# EAGLE schematic qo-100-upconverter (EAGLE 9.6.2)
CREVISION: 3; DESIGNER: Joao Silva

## Sheet 1 of 7: MCU
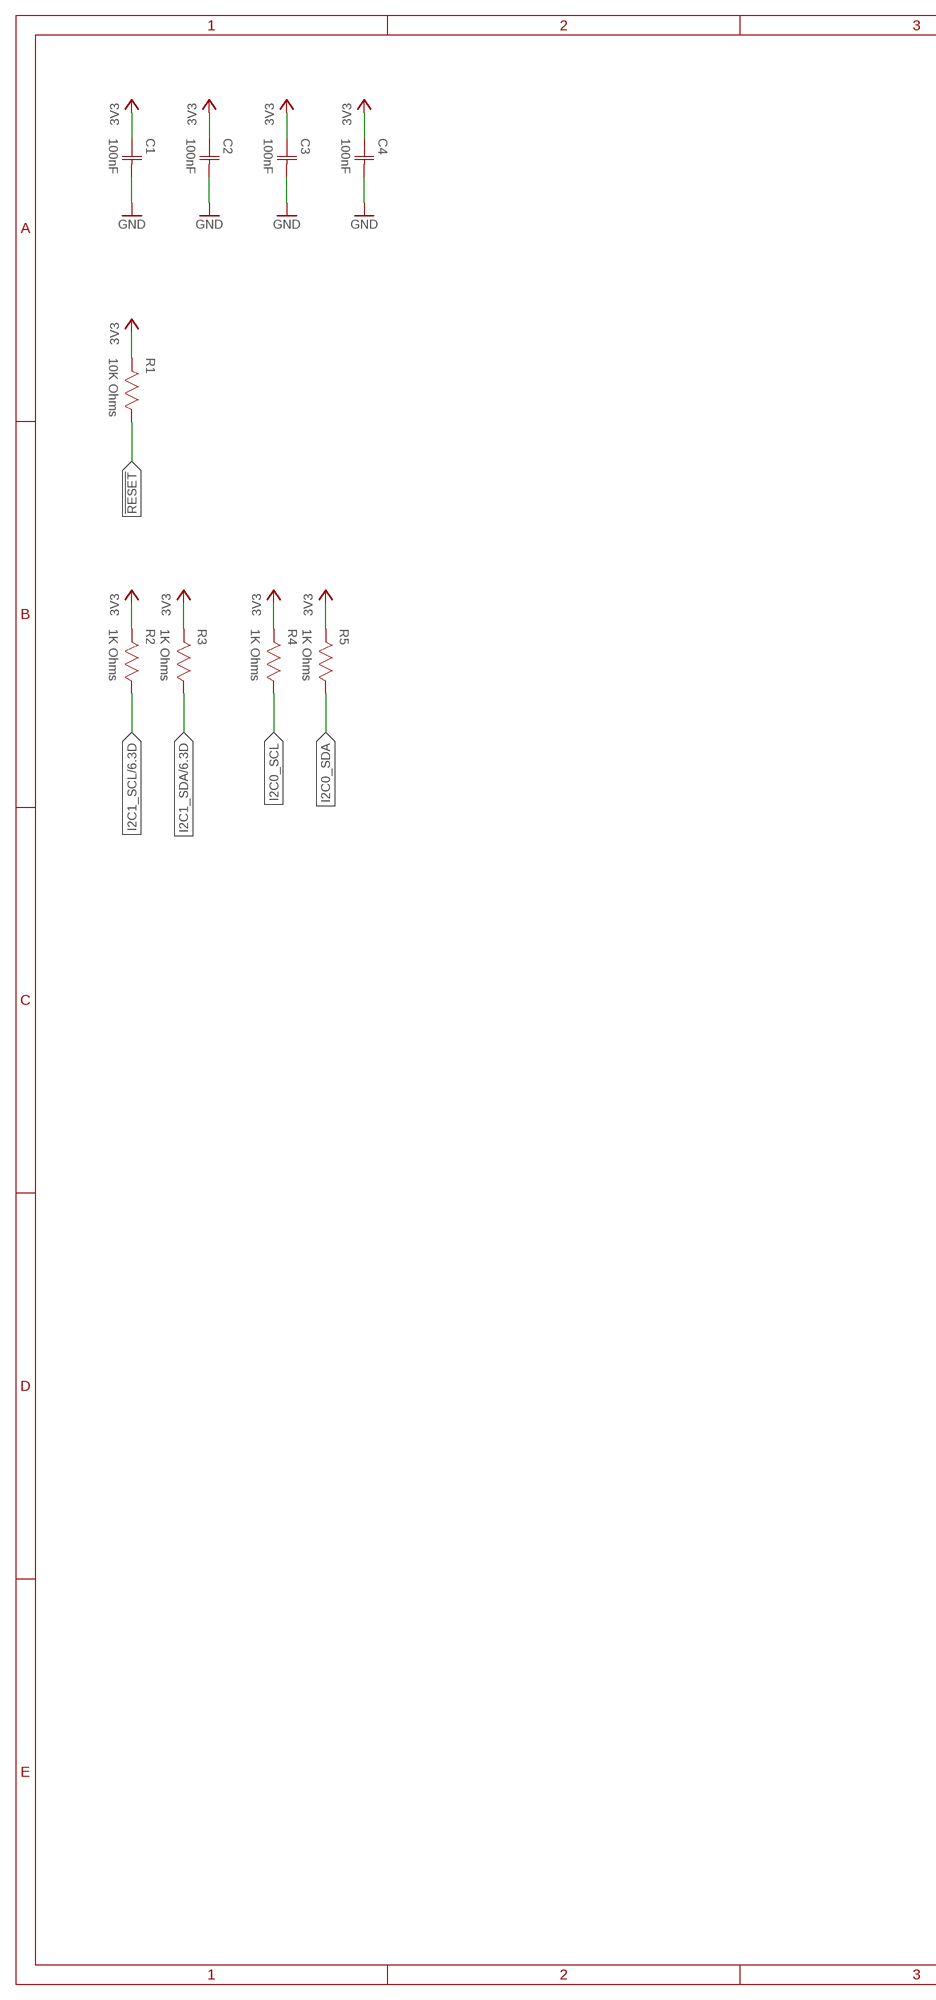
[diagram p0: schematic, sheet 1, part 1 of 2]
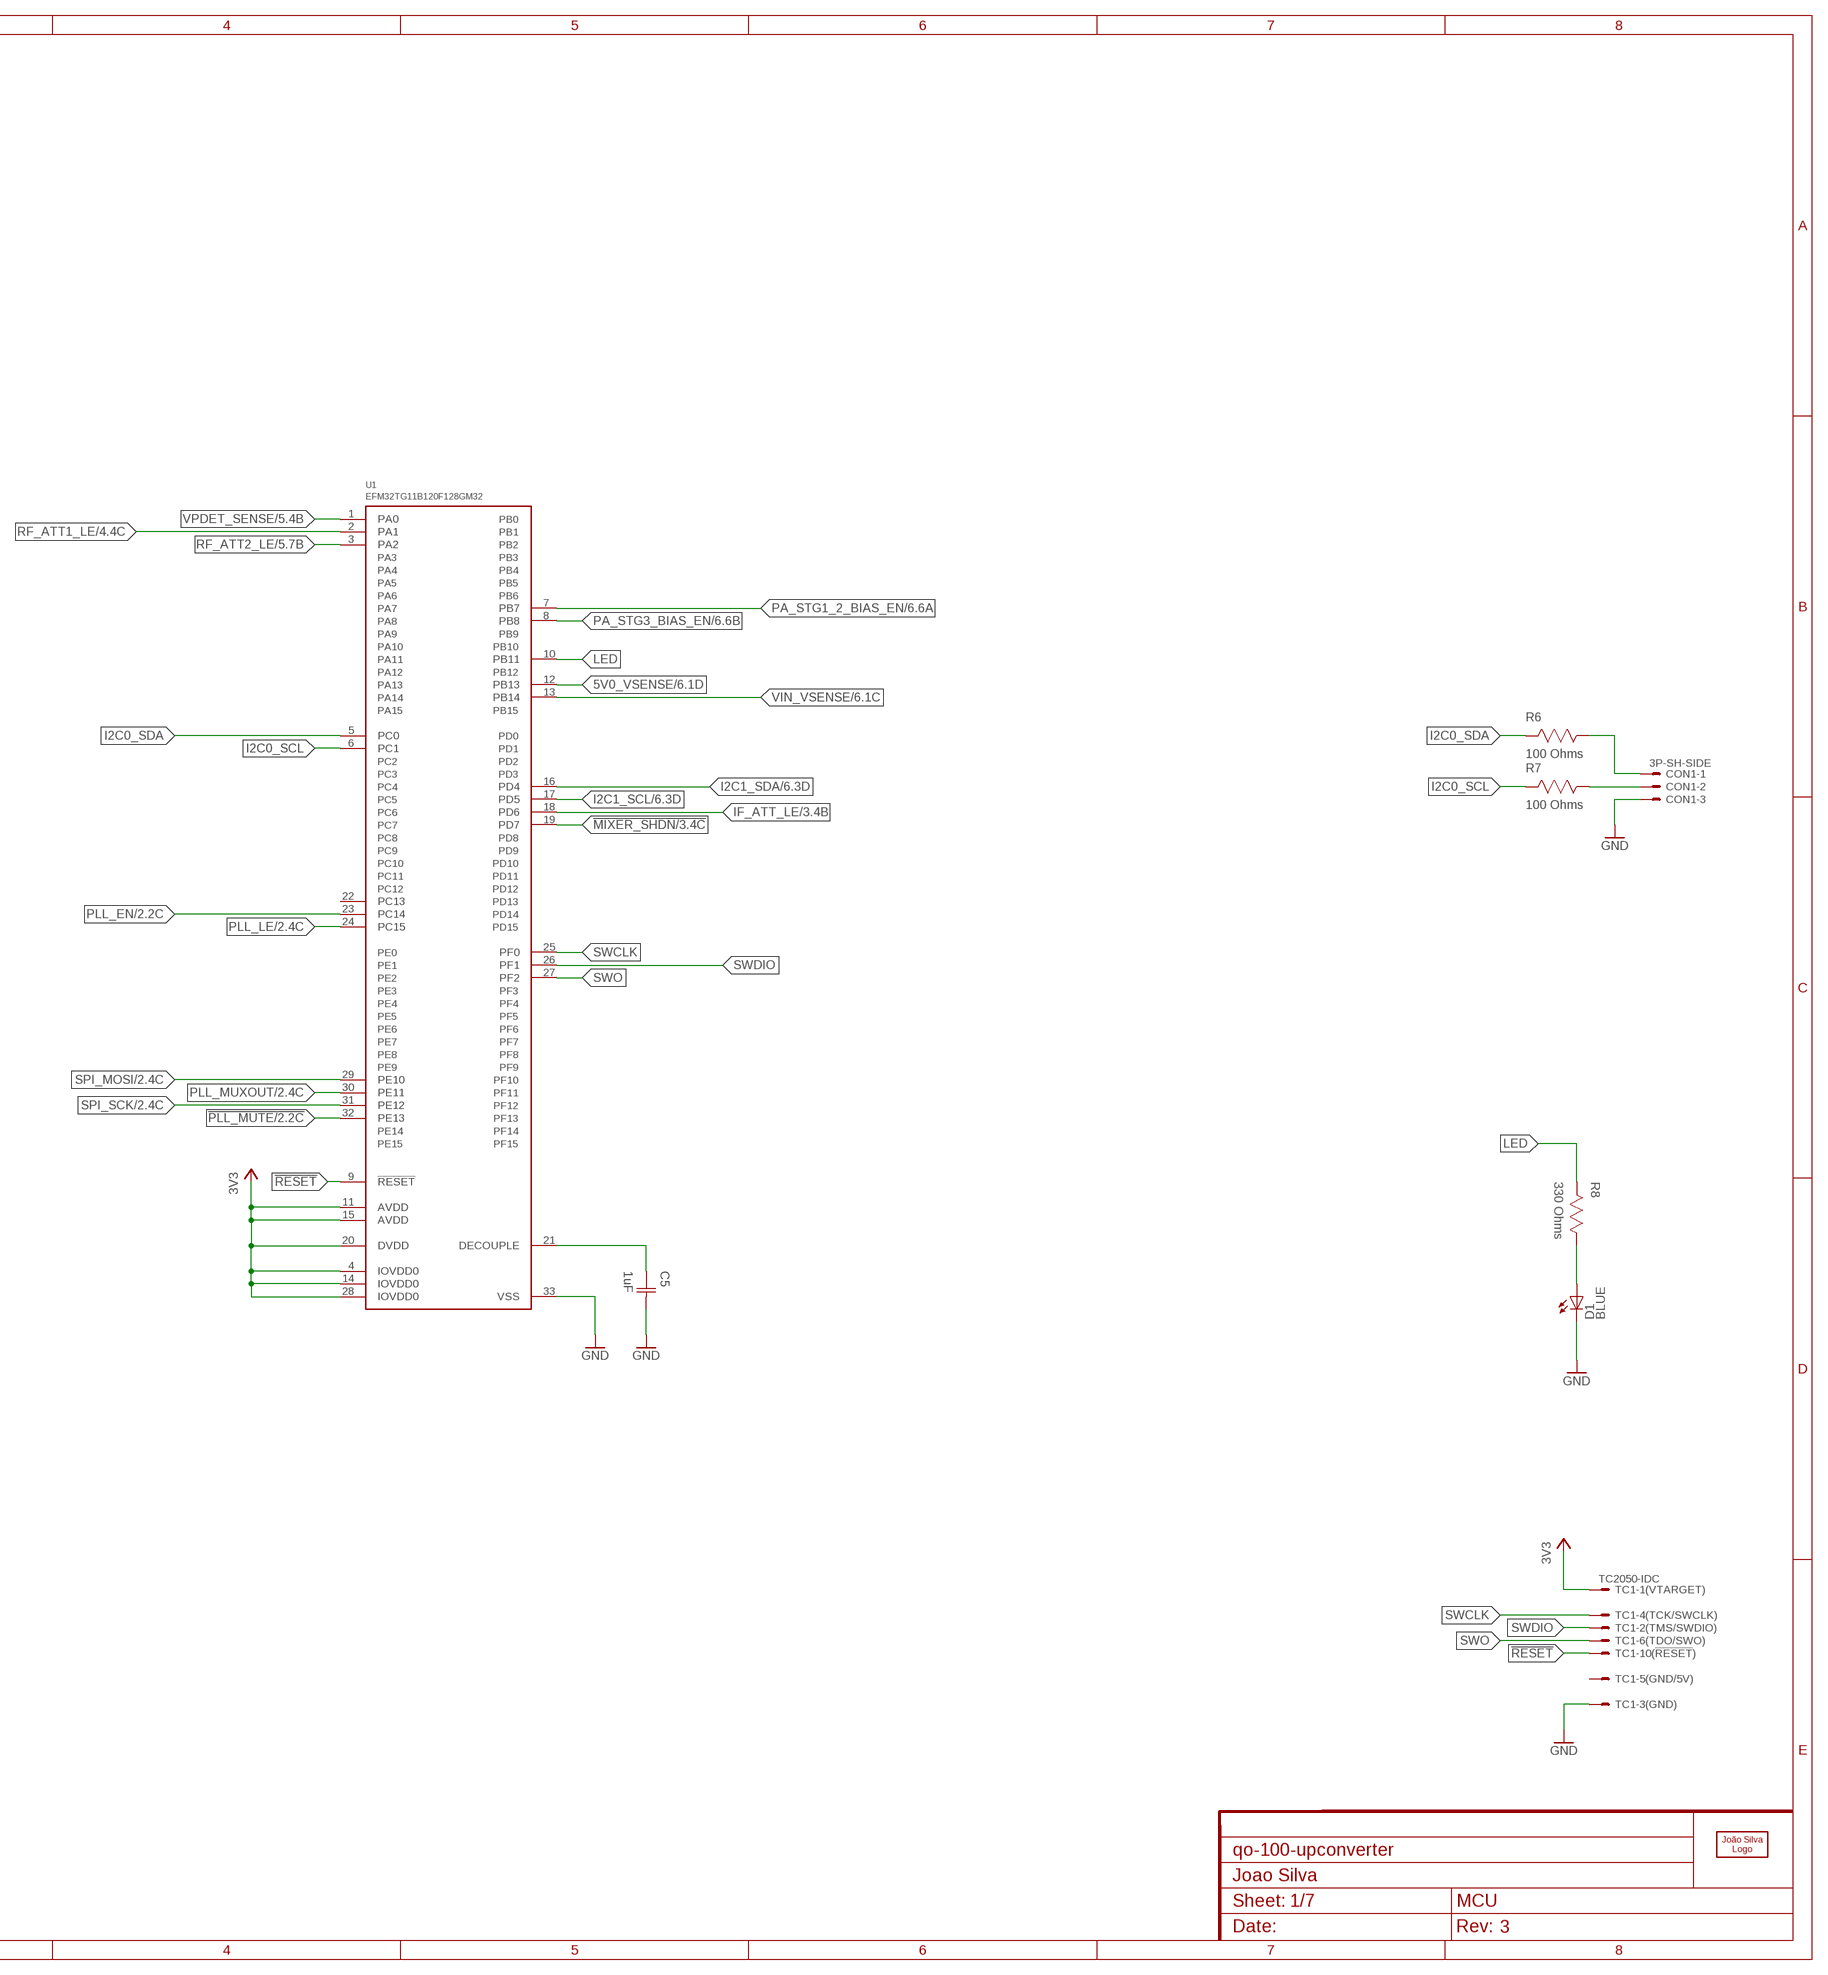
[diagram p1: schematic, sheet 1, part 2 of 2]

### Parts
C1  100nF  CAPACITOR-0603  [CAP0603]
C2  100nF  CAPACITOR-0603  [CAP0603]
C3  100nF  CAPACITOR-0603  [CAP0603]
C4  100nF  CAPACITOR-0603  [CAP0603]
C5  1uF  CAPACITOR-0603  [CAP0603]
CON1  3P-SH-SIDE  [SH-03-SIDE]
D1  LED0603  [0603]
LOGO1  JS-5MM  [JS_5MM]
R1  10K Ohms  RESISTOR-0603  [RES0603]
R2  1K Ohms  RESISTOR-0603  [RES0603]
R3  1K Ohms  RESISTOR-0603  [RES0603]
R4  1K Ohms  RESISTOR-0603  [RES0603]
R5  1K Ohms  RESISTOR-0603  [RES0603]
R6  100 Ohms  RESISTOR-0603  [RES0603]
R7  100 Ohms  RESISTOR-0603  [RES0603]
R8  330 Ohms  RESISTOR-0603  [RES0603]
TC1  TC2050-IDC  [TC2050-IDC]
U1  EFM32TG11B120F128GM32  [QFN32_0.5P_TG]

### Nets
3V3: C1.1(C1) C2.1(C1) C3.1(C1) C4.1(C1) R1.2 R2.2 R3.2 R4.2 R5.2 TC1.1 U1.4(IOVDD0) U1.11(AVDD) U1.14(IOVDD0) U1.15(AVDD) U1.20(DVDD) U1.28(IOVDD0) ; also sheet 6
5V0_VSENSE: U1.12(PB13) ; also sheet 6
!MIXER_SHDN: U1.19(PD7) ; also sheet 3
!PLL_MUTE: U1.32(PE13) ; also sheet 2
!RESET: R1.1 TC1.10 U1.9(!RESET)
GND: C1.2(C2) C2.2(C2) C3.2(C2) C4.2(C2) C5.2(C2) CON1.3 D1.C TC1.3 U1.33(VSS) ; also sheet 2,3,4,5,6
I2C0_SCL: R4.1 R7.2 U1.6(PC1)
I2C0_SDA: R5.1 R6.2 U1.5(PC0)
I2C1_SCL: R2.1 U1.17(PD5) ; also sheet 6
I2C1_SDA: R3.1 U1.16(PD4) ; also sheet 6
IF_ATT_LE: U1.18(PD6) ; also sheet 3
LED: R8.2 U1.10(PB11)
N$11: CON1.2 R7.1
N$17: CON1.1 R6.1
N$22: C5.1(C1) U1.21(DECOUPLE)
N$25: D1.A R8.1
PA_STG1_2_BIAS_EN: U1.7(PB7) ; also sheet 6
PA_STG3_BIAS_EN: U1.8(PB8) ; also sheet 6
PLL_EN: U1.23(PC14) ; also sheet 2
PLL_LE: U1.24(PC15) ; also sheet 2
PLL_MUXOUT: U1.30(PE11) ; also sheet 2
RF_ATT1_LE: U1.2(PA1) ; also sheet 4
RF_ATT2_LE: U1.3(PA2) ; also sheet 5
SPI_MOSI: U1.29(PE10) ; also sheet 2,3,4,5
SPI_SCK: U1.31(PE12) ; also sheet 2,3,4,5
SWCLK: TC1.4 U1.25(PF0)
SWDIO: TC1.2 U1.26(PF1)
SWO: TC1.6 U1.27(PF2)
VIN_VSENSE: U1.13(PB14) ; also sheet 6
VPDET_SENSE: U1.1(PA0) ; also sheet 5
Unconnected: TC1.5 TC1.7 TC1.8 TC1.9 U1.22(PC13)

## Sheet 2 of 7: LO Synthesizer
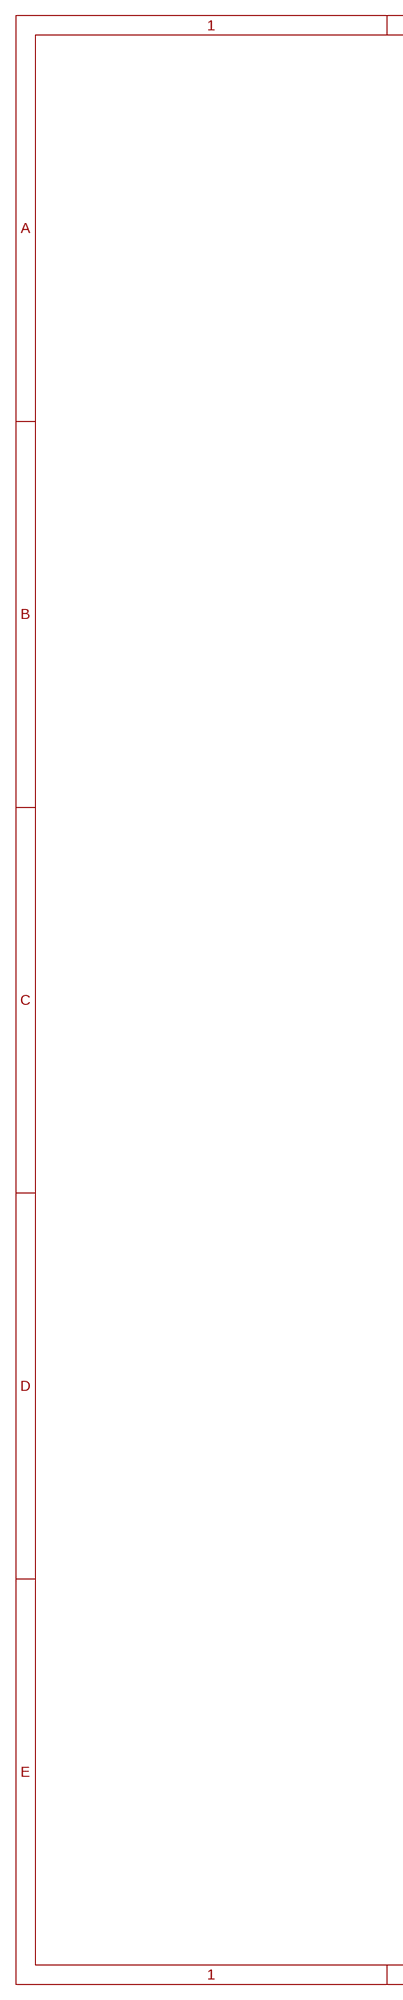
[diagram p2: schematic, sheet 2, part 1 of 2]
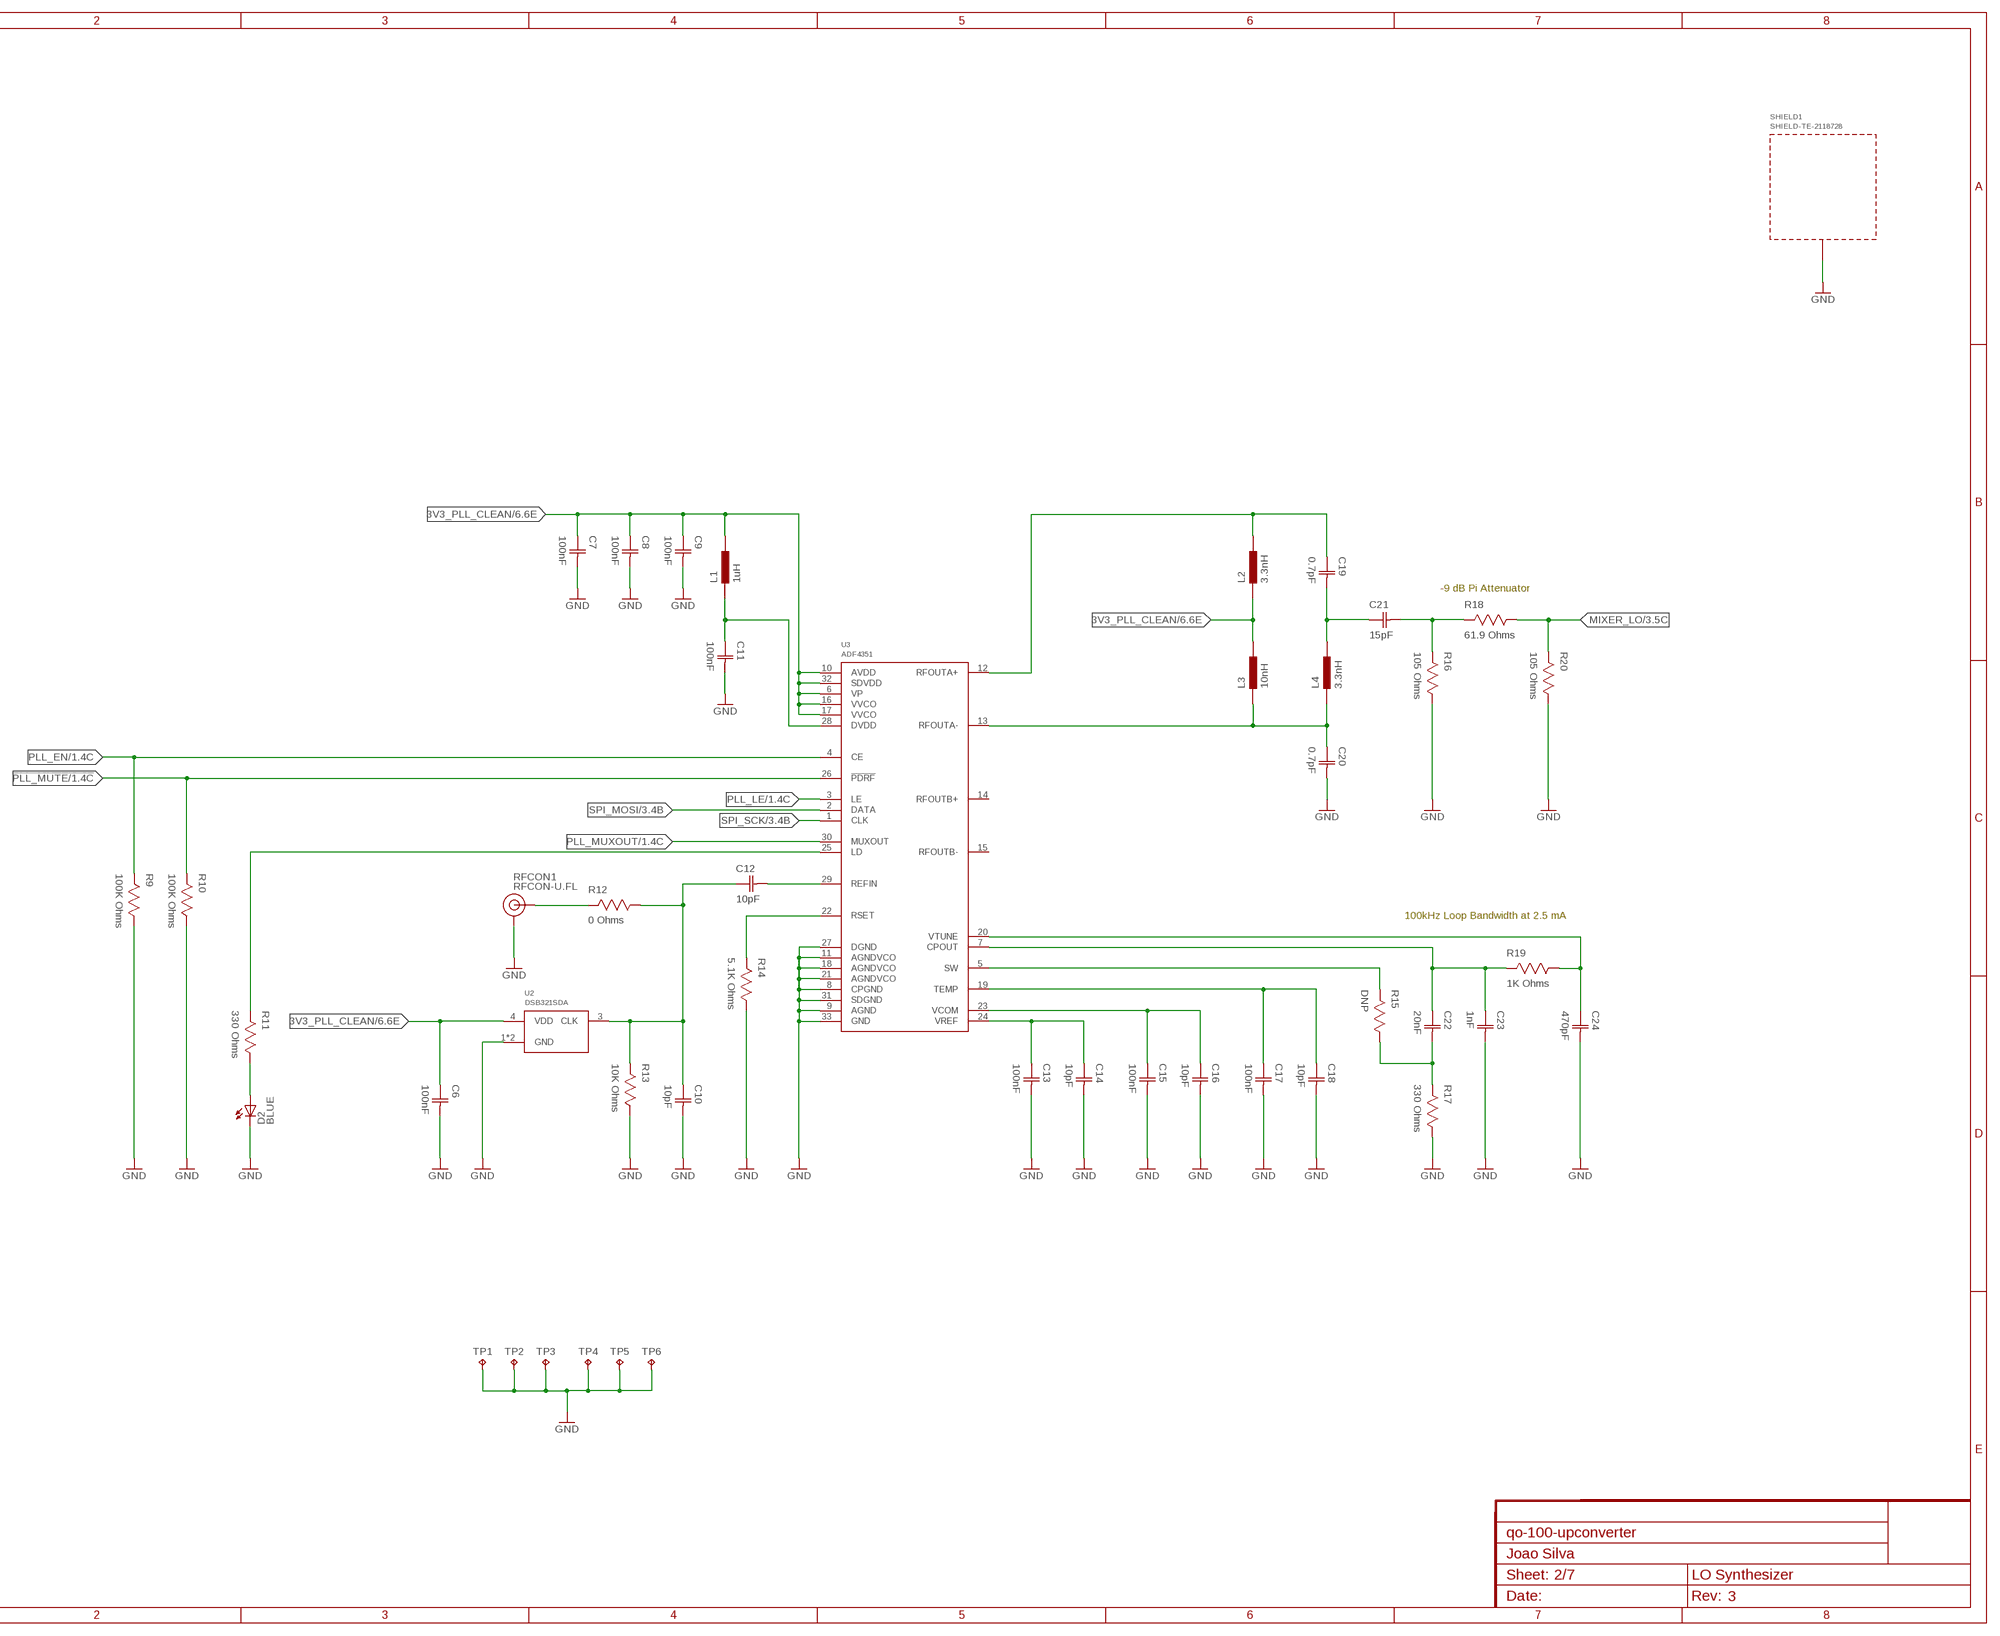
[diagram p3: schematic, sheet 2, part 2 of 2]

### Parts
C6  100nF  CAPACITOR-0603  [CAP0603]
C7  100nF  CAPACITOR-0603  [CAP0603]
C8  100nF  CAPACITOR-0603  [CAP0603]
C9  100nF  CAPACITOR-0603  [CAP0603]
C10  10pF  CAPACITOR-0603  [CAP0603]
C11  100nF  CAPACITOR-0603  [CAP0603]
C12  10pF  CAPACITOR-0603  [CAP0603]
C13  100nF  CAPACITOR-0603  [CAP0603]
C14  10pF  CAPACITOR-0603  [CAP0603]
C15  100nF  CAPACITOR-0603  [CAP0603]
C16  10pF  CAPACITOR-0603  [CAP0603]
C17  100nF  CAPACITOR-0603  [CAP0603]
C18  10pF  CAPACITOR-0603  [CAP0603]
C19  0.7pF  CAPACITOR-0603  [CAP0603]
C20  0.7pF  CAPACITOR-0603  [CAP0603]
C21  15pF  CAPACITOR-0603  [CAP0603]
C22  20nF  CAPACITOR-0603  [CAP0603]
C23  1nF  CAPACITOR-0603  [CAP0603]
C24  470pF  CAPACITOR-0603  [CAP0603]
D2  LED0603  [0603]
L1  1uH  INDUCTOR-0603  [IND0603]
L2  3.3nH  INDUCTOR-0603  [IND0603]
L3  10nH  INDUCTOR-0603  [IND0603]
L4  3.3nH  INDUCTOR-0603  [IND0603]
R9  100K Ohms  RESISTOR-0603  [RES0603]
R10  100K Ohms  RESISTOR-0603  [RES0603]
R11  330 Ohms  RESISTOR-0603  [RES0603]
R12  0 Ohms  RESISTOR-0603  [RES0603]
R13  10K Ohms  RESISTOR-0603  [RES0603]
R14  5.1K Ohms  RESISTOR-0603  [RES0603]
R15  DNP  RESISTOR-0603  [RES0603]
R16  105 Ohms  RESISTOR-0603  [RES0603]
R17  330 Ohms  RESISTOR-0603  [RES0603]
R18  61.9 Ohms  RESISTOR-0603  [RES0603]
R19  1K Ohms  RESISTOR-0603  [RES0603]
R20  105 Ohms  RESISTOR-0603  [RES0603]
RFCON1  RFCON-U.FL  [U.FL]
SHIELD1  SHIELD-TE-2118728  [2118728]
TP1  TESTPOINT-1.27MM  [PAD1.27MM]
TP2  TESTPOINT-1.27MM  [PAD1.27MM]
TP3  TESTPOINT-1.27MM  [PAD1.27MM]
TP4  TESTPOINT-1.27MM  [PAD1.27MM]
TP5  TESTPOINT-1.27MM  [PAD1.27MM]
TP6  TESTPOINT-1.27MM  [PAD1.27MM]
U2  DSB321SDA  [TCXO-3225]
U3  ADF4351  [QFN32]

### Nets
3V3_PLL_CLEAN: C6.1(C1) C7.1(C1) C8.1(C1) C9.1(C1) L1.2 L2.1 L3.2 U2.4(VDD) U3.6(VP) U3.10(AVDD) U3.16(VVCO) U3.17(VVCO) U3.32(SDVDD) ; also sheet 6
!PLL_MUTE: R10.2 U3.26(!PDRF) ; also sheet 1
GND: C6.2(C2) C7.2(C2) C8.2(C2) C9.2(C2) C10.2(C2) C11.2(C2) C13.2(C2) C14.2(C2) C15.2(C2) C16.2(C2) C17.2(C2) C18.2(C2) C20.2(C2) C23.2(C2) C24.2(C2) D2.C R9.1 R10.1 R13.1 R14.1 R16.1 R17.1 R20.1 RFCON1.P$1(GND) RFCON1.P$2(GND) SHIELD1.1(GND) SHIELD1.2(GND) SHIELD1.3(GND) SHIELD1.4(GND) SHIELD1.5(GND) SHIELD1.6(GND) SHIELD1.7(GND) SHIELD1.8(GND) SHIELD1.9(GND) SHIELD1.10(GND) SHIELD1.11(GND) SHIELD1.12(GND) SHIELD1.13(GND) SHIELD1.14(GND) SHIELD1.15(GND) SHIELD1.16(GND) TP1.TP TP2.TP TP3.TP TP4.TP TP5.TP TP6.TP U2.1(GND) U2.2(GND) U3.8(CPGND) U3.9(AGND) U3.11(AGNDVCO) U3.18(AGNDVCO) U3.21(AGNDVCO) U3.27(DGND) U3.31(SDGND) U3.33(GND) ; also sheet 1,3,4,5,6
MIXER_LO: R18.1 R20.2 ; also sheet 3
N$1: C19.2(C2) C21.1(C1) L4.2
N$8: C11.1(C1) L1.1 U3.28(DVDD)
N$13: D2.A R11.1
N$21: R12.2 RFCON1.P$3(SIGNAL)
N$29: C21.2(C2) R16.2 R18.2
N$67: C20.1(C1) L3.1 L4.1 U3.13(RFOUTA-)
N$69: C19.1(C1) L2.2 U3.12(RFOUTA+)
N$84: C22.2(C2) R15.1 R17.2
N$88: R14.2 U3.22(RSET)
PLL_CP_VOUT: C22.1(C1) C23.1(C1) R19.2 U3.7(CPOUT)
PLL_EN: R9.2 U3.4(CE) ; also sheet 1
PLL_FASTLOCK_SW: R15.2 U3.5(SW)
PLL_LE: U3.3(LE) ; also sheet 1
PLL_LOCK: R11.2 U3.25(LD)
PLL_MUXOUT: U3.30(MUXOUT) ; also sheet 1
PLL_REF_ACC: C12.2(C2) U3.29(REFIN)
PLL_REF_DCC: C10.1(C1) C12.1(C1) R12.1 R13.2 U2.3(CLK)
PLL_TEMP: C17.1(C1) C18.1(C1) U3.19(TEMP)
PLL_VCOM: C15.1(C1) C16.1(C1) U3.23(VCOM)
PLL_VREF: C13.1(C1) C14.1(C1) U3.24(VREF)
PLL_VTUNE: C24.1(C1) R19.1 U3.20(VTUNE)
SPI_MOSI: U3.2(DATA) ; also sheet 1,3,4,5
SPI_SCK: U3.1(CLK) ; also sheet 1,3,4,5
Unconnected: U3.14(RFOUTB+) U3.15(RFOUTB-)

### Notes on the sheet
- -9 dB Pi Attenuator
- 100kHz Loop Bandwidth at 2.5 mA

## Sheet 3 of 7: IF + Mixer + LOL Filter
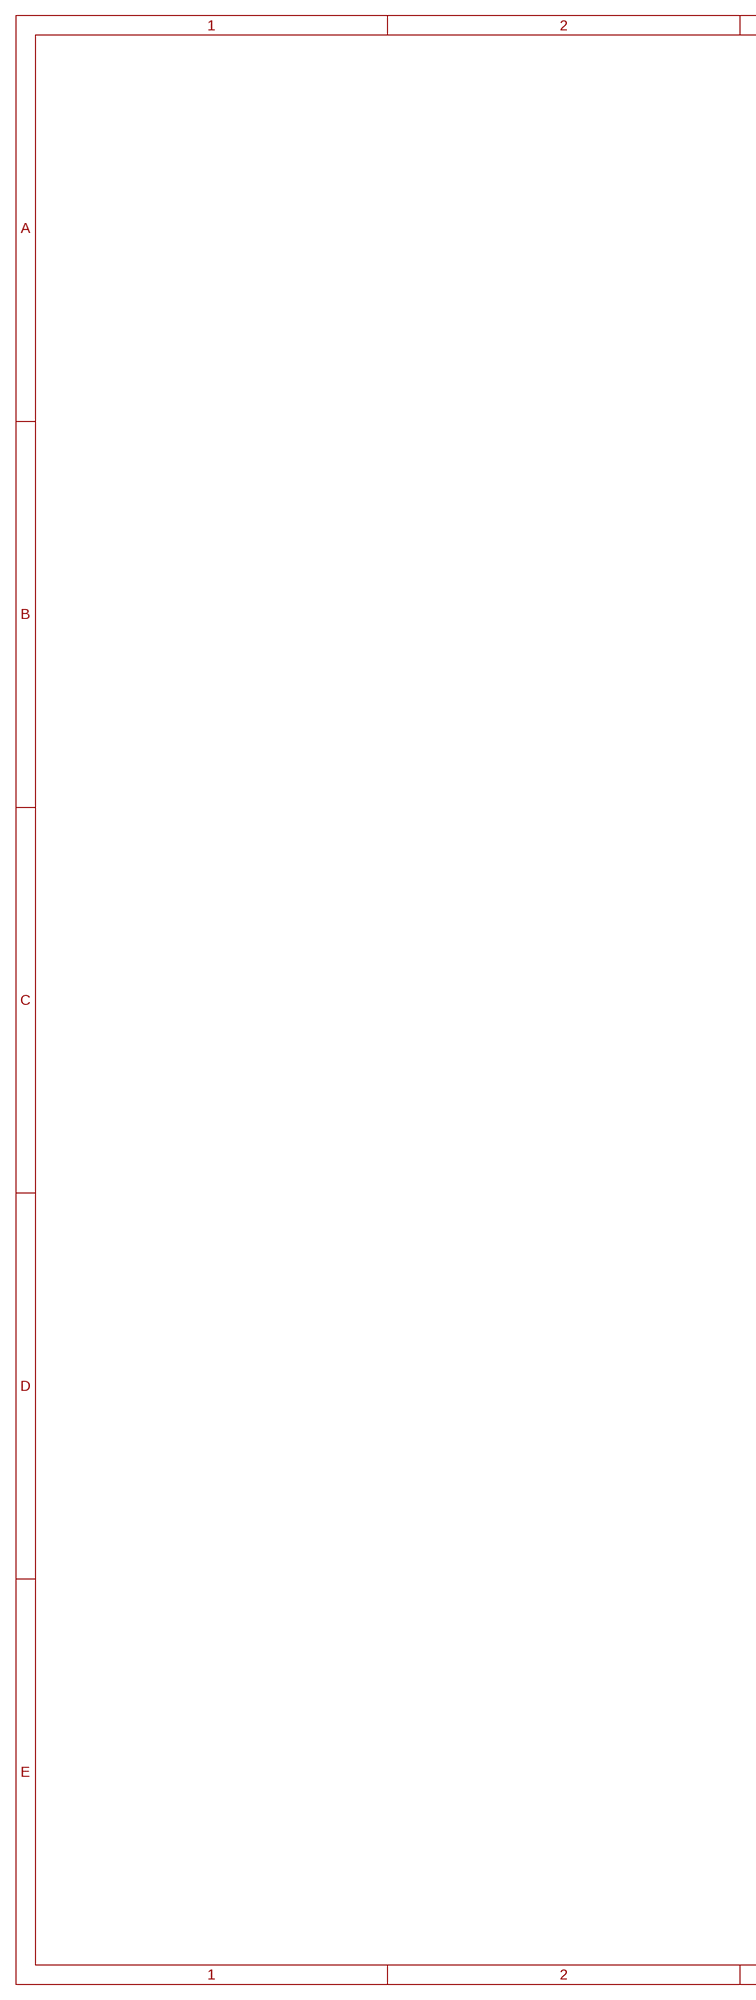
[diagram p4: schematic, sheet 3, part 1 of 2]
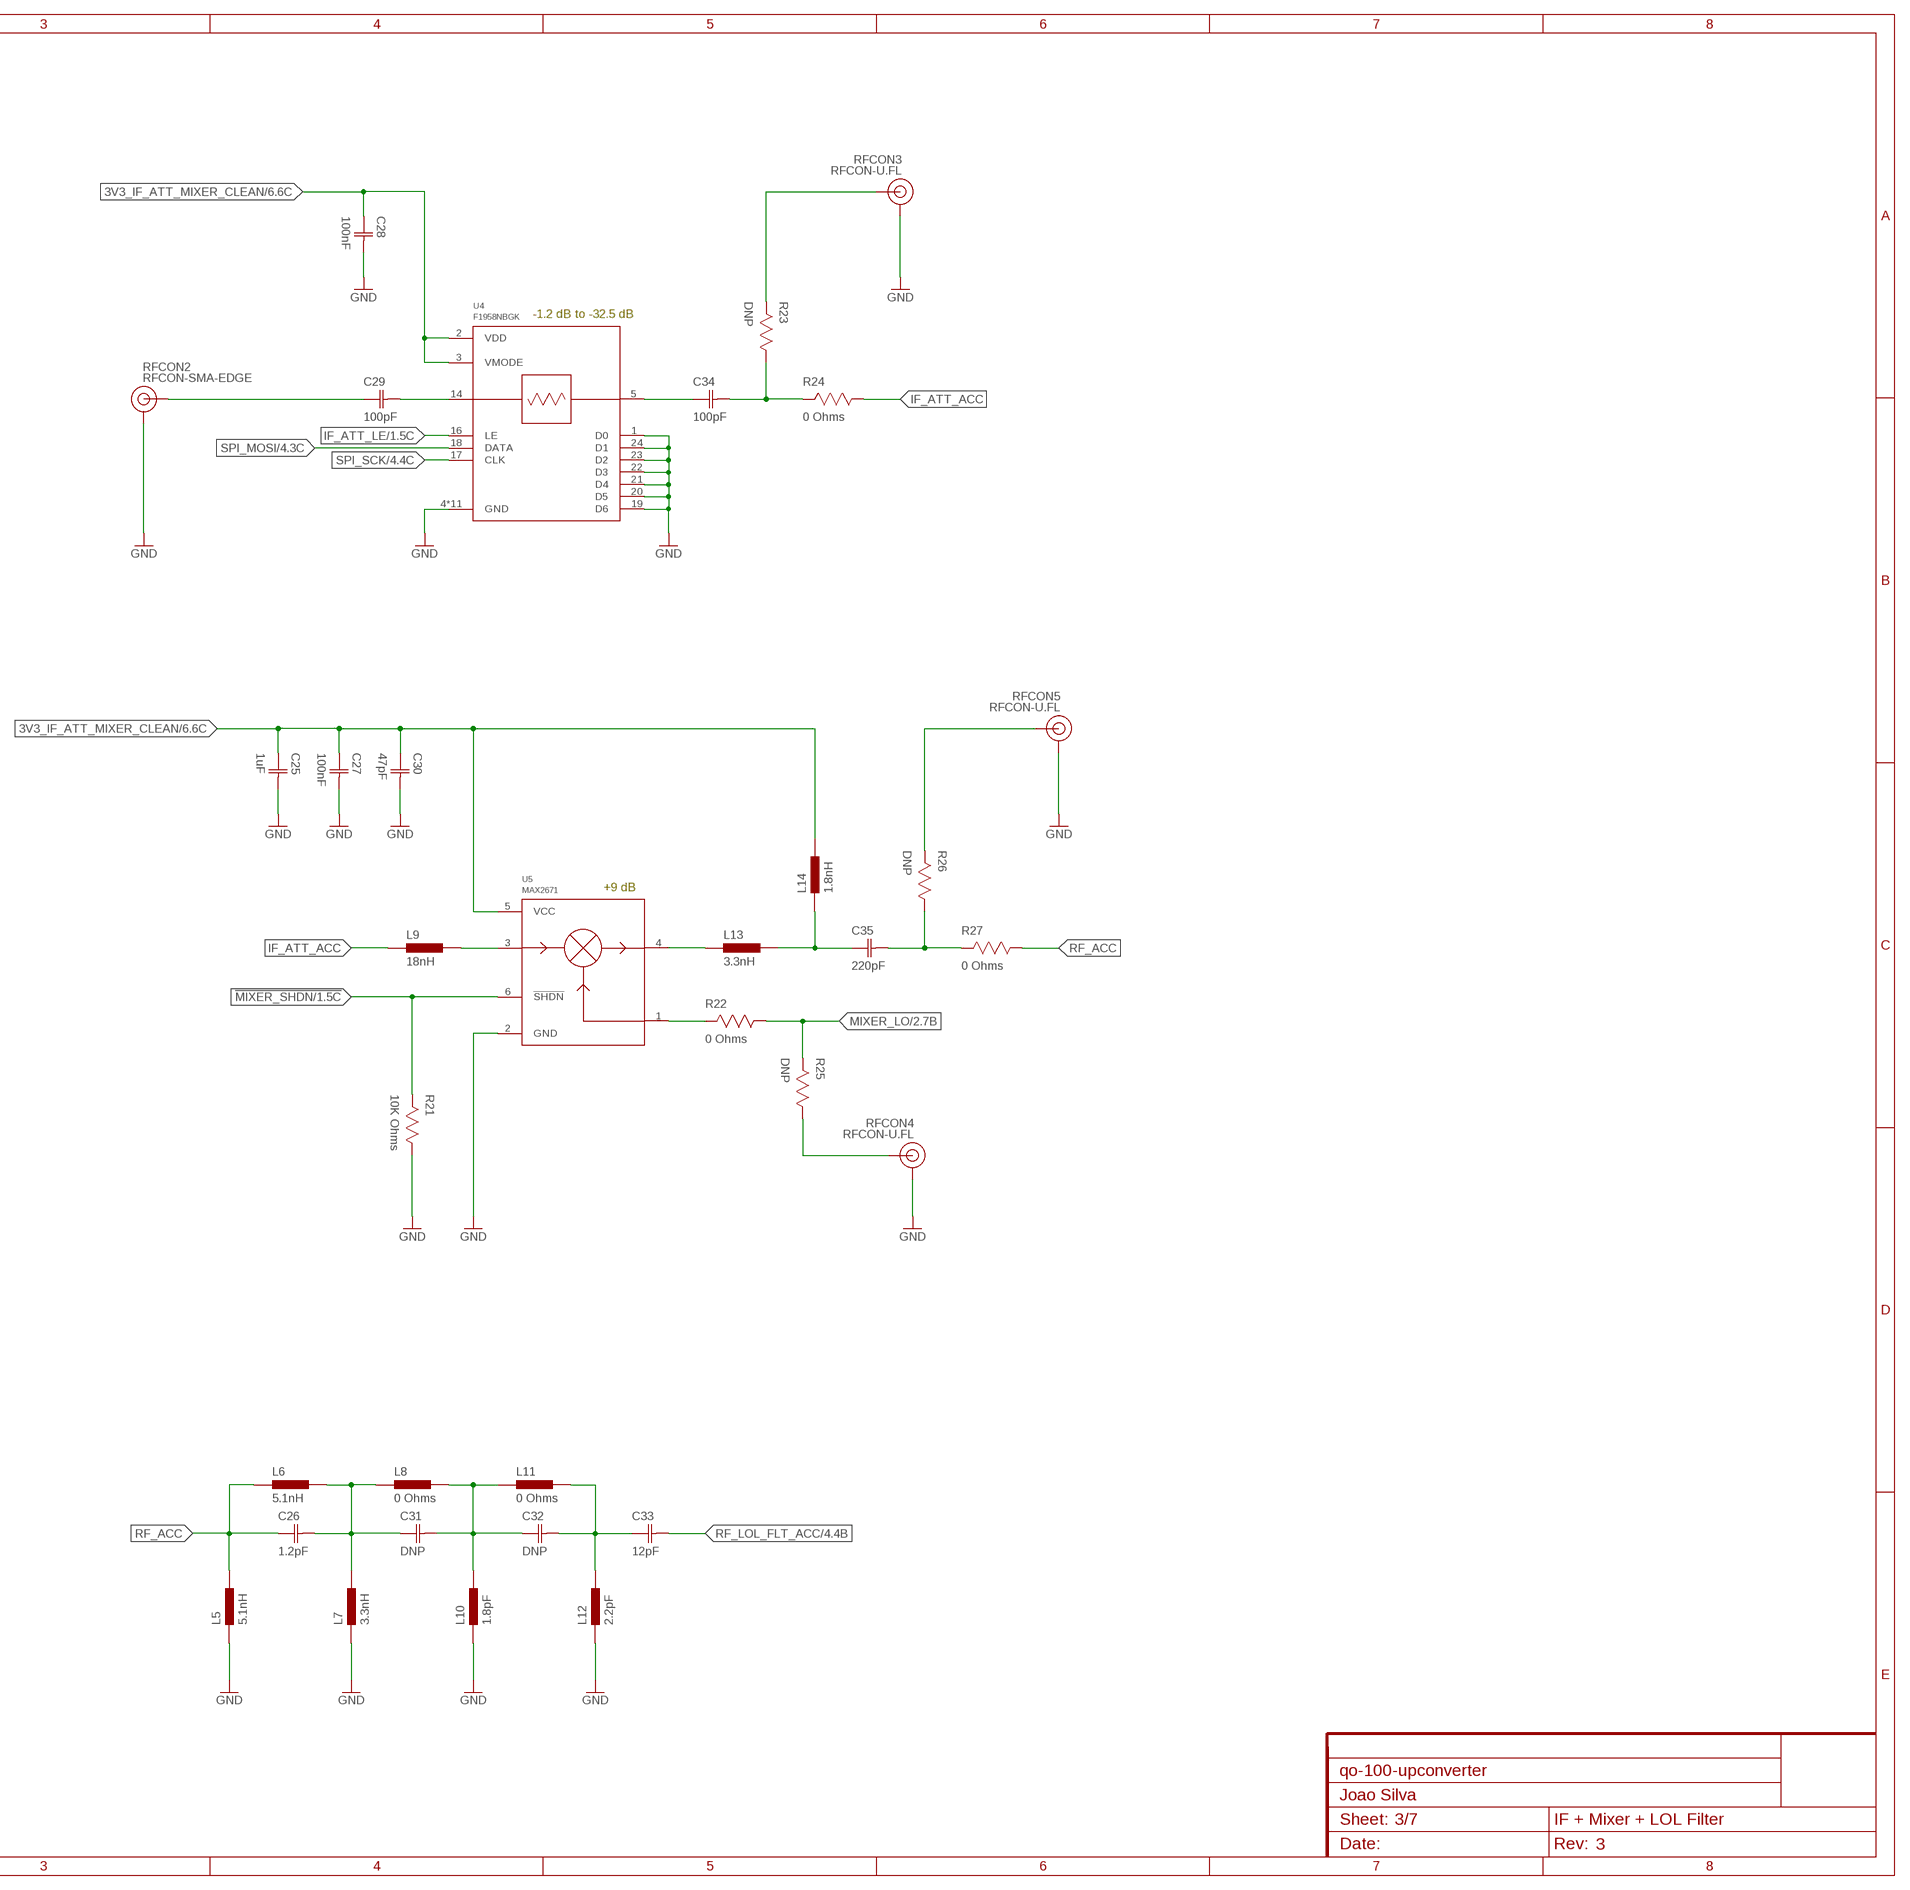
[diagram p5: schematic, sheet 3, part 2 of 2]

### Parts
C25  1uF  CAPACITOR-0603  [CAP0603]
C26  1.2pF  CAPACITOR-0603  [CAP0603]
C27  100nF  CAPACITOR-0603  [CAP0603]
C28  100nF  CAPACITOR-0603  [CAP0603]
C29  100pF  CAPACITOR-0603  [CAP0603]
C30  47pF  CAPACITOR-0603  [CAP0603]
C31  DNP  CAPACITOR-0603  [CAP0603]
C32  DNP  CAPACITOR-0603  [CAP0603]
C33  12pF  CAPACITOR-0603  [CAP0603]
C34  100pF  CAPACITOR-0603  [CAP0603]
C35  220pF  CAPACITOR-0603  [CAP0603]
L5  5.1nH  INDUCTOR-0603  [IND0603]
L6  5.1nH  INDUCTOR-0603  [IND0603]
L7  3.3nH  INDUCTOR-0603  [IND0603]
L8  0 Ohms  INDUCTOR-0603  [IND0603]
L9  18nH  INDUCTOR-0603  [IND0603]
L10  1.8pF  INDUCTOR-0603  [IND0603]
L11  0 Ohms  INDUCTOR-0603  [IND0603]
L12  2.2pF  INDUCTOR-0603  [IND0603]
L13  3.3nH  INDUCTOR-0603  [IND0603]
L14  1.8nH  INDUCTOR-0603  [IND0603]
R21  10K Ohms  RESISTOR-0603  [RES0603]
R22  0 Ohms  RESISTOR-0603  [RES0603]
R23  DNP  RESISTOR-0603  [RES0603]
R24  0 Ohms  RESISTOR-0603  [RES0603]
R25  DNP  RESISTOR-0603  [RES0603]
R26  DNP  RESISTOR-0603  [RES0603]
R27  0 Ohms  RESISTOR-0603  [RES0603]
RFCON2  RFCON-SMA-EDGE  [SMA-EDGE]
RFCON3  RFCON-U.FL  [U.FL]
RFCON4  RFCON-U.FL  [U.FL]
RFCON5  RFCON-U.FL  [U.FL]
U4  F1958NBGK  [QFN24_2]
U5  MAX2671  [SOT23-6]

### Nets
3V3_IF_ATT_MIXER_CLEAN: C25.1(C1) C27.1(C1) C28.1(C1) C30.1(C1) L14.2 U4.2(VDD) U4.3(VMODE) U5.5(VCC) ; also sheet 6
!MIXER_SHDN: R21.2 U5.6(!SHDN) ; also sheet 1
GND: C25.2(C2) C27.2(C2) C28.2(C2) C30.2(C2) L5.1 L7.1 L10.1 L12.1 R21.1 RFCON2.GND@0(GND) RFCON2.GND@1(GND) RFCON2.GND@2(GND) RFCON2.GND@3(GND) RFCON3.P$1(GND) RFCON3.P$2(GND) RFCON4.P$1(GND) RFCON4.P$2(GND) RFCON5.P$1(GND) RFCON5.P$2(GND) U4.1(D0) U4.4(GND) U4.6(GND) U4.7(GND) U4.8(GND) U4.9(GND) U4.10(GND) U4.11(GND) U4.12(GND) U4.13(GND) U4.15(GND) U4.19(D6) U4.20(D5) U4.21(D4) U4.22(D3) U4.23(D2) U4.24(D1) U4.25(GND) U5.2(GND) ; also sheet 1,2,4,5,6
IF_ATT_ACC: L9.1 R24.1
IF_ATT_ACC_PROBE: C34.2(C2) R23.1 R24.2
IF_ATT_DCC: C34.1(C1) U4.5(RF1)
IF_ATT_LE: U4.16(LE) ; also sheet 1
IF_IN_ACC: C29.2(C2) U4.14(RF2)
IF_IN_DCC: C29.1(C1) RFCON2.SIG(SIGNAL)
MIXER_IN_DCC: L9.2 U5.3(IFIN)
MIXER_LO: R22.1 R25.2 ; also sheet 2
MIXER_OUT_ACC_PROBE: C35.2(C2) R26.1 R27.2
MIXER_OUT_DCC: L13.1 U5.4(RFOUT)
N$6: C35.1(C1) L13.2 L14.1
N$24: R23.2 RFCON3.P$3(SIGNAL)
N$28: R26.2 RFCON5.P$3(SIGNAL)
N$32: C26.2(C2) C31.1(C1) L6.2 L7.2 L8.1
N$33: C31.2(C2) C32.1(C1) L8.2 L10.2 L11.1
N$34: C32.2(C2) C33.1(C1) L11.2 L12.2
N$45: R22.2 U5.1(LO)
N$47: R25.1 RFCON4.P$3(SIGNAL)
RF_ACC: C26.1(C1) L5.2 L6.1 R27.1
RF_LOL_FLT_ACC: C33.2(C2) ; also sheet 4
SPI_MOSI: U4.18(DATA) ; also sheet 1,2,4,5
SPI_SCK: U4.17(CLK) ; also sheet 1,2,4,5

### Notes on the sheet
- -1.2 dB to -32.5 dB
- +9 dB

## Sheet 4 of 7: Stage 1 & 2 amplifier
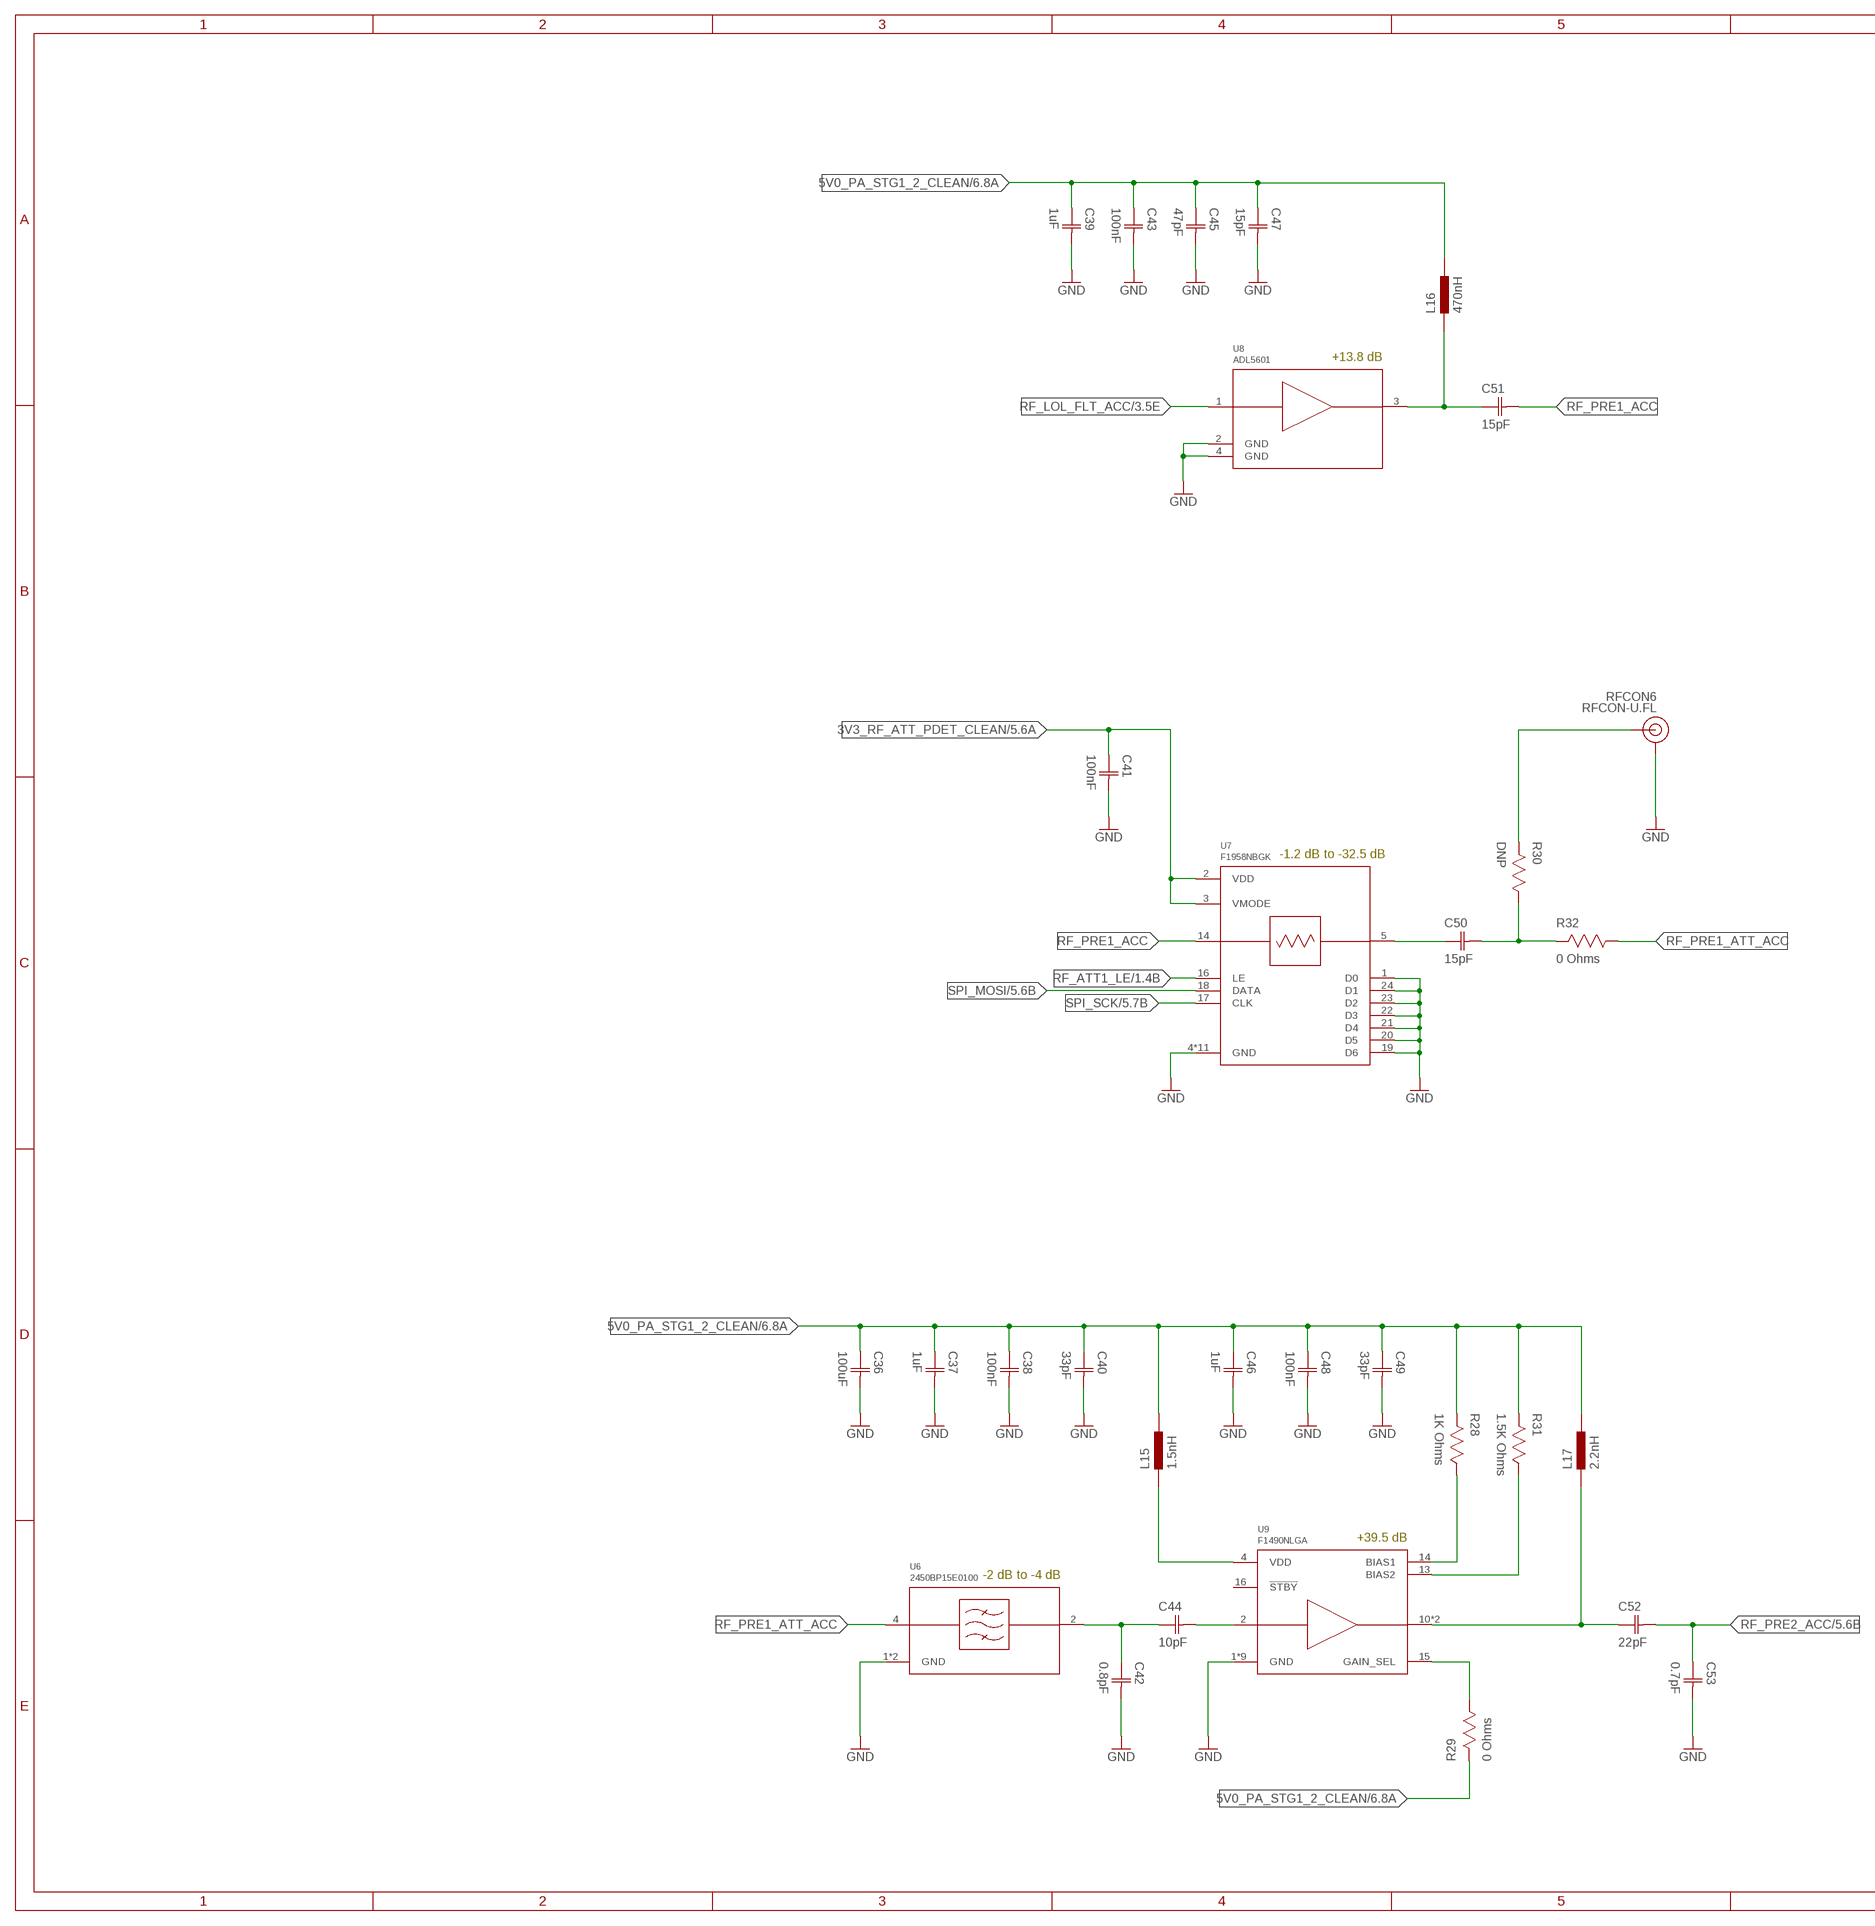
[diagram p6: schematic, sheet 4, part 1 of 2]
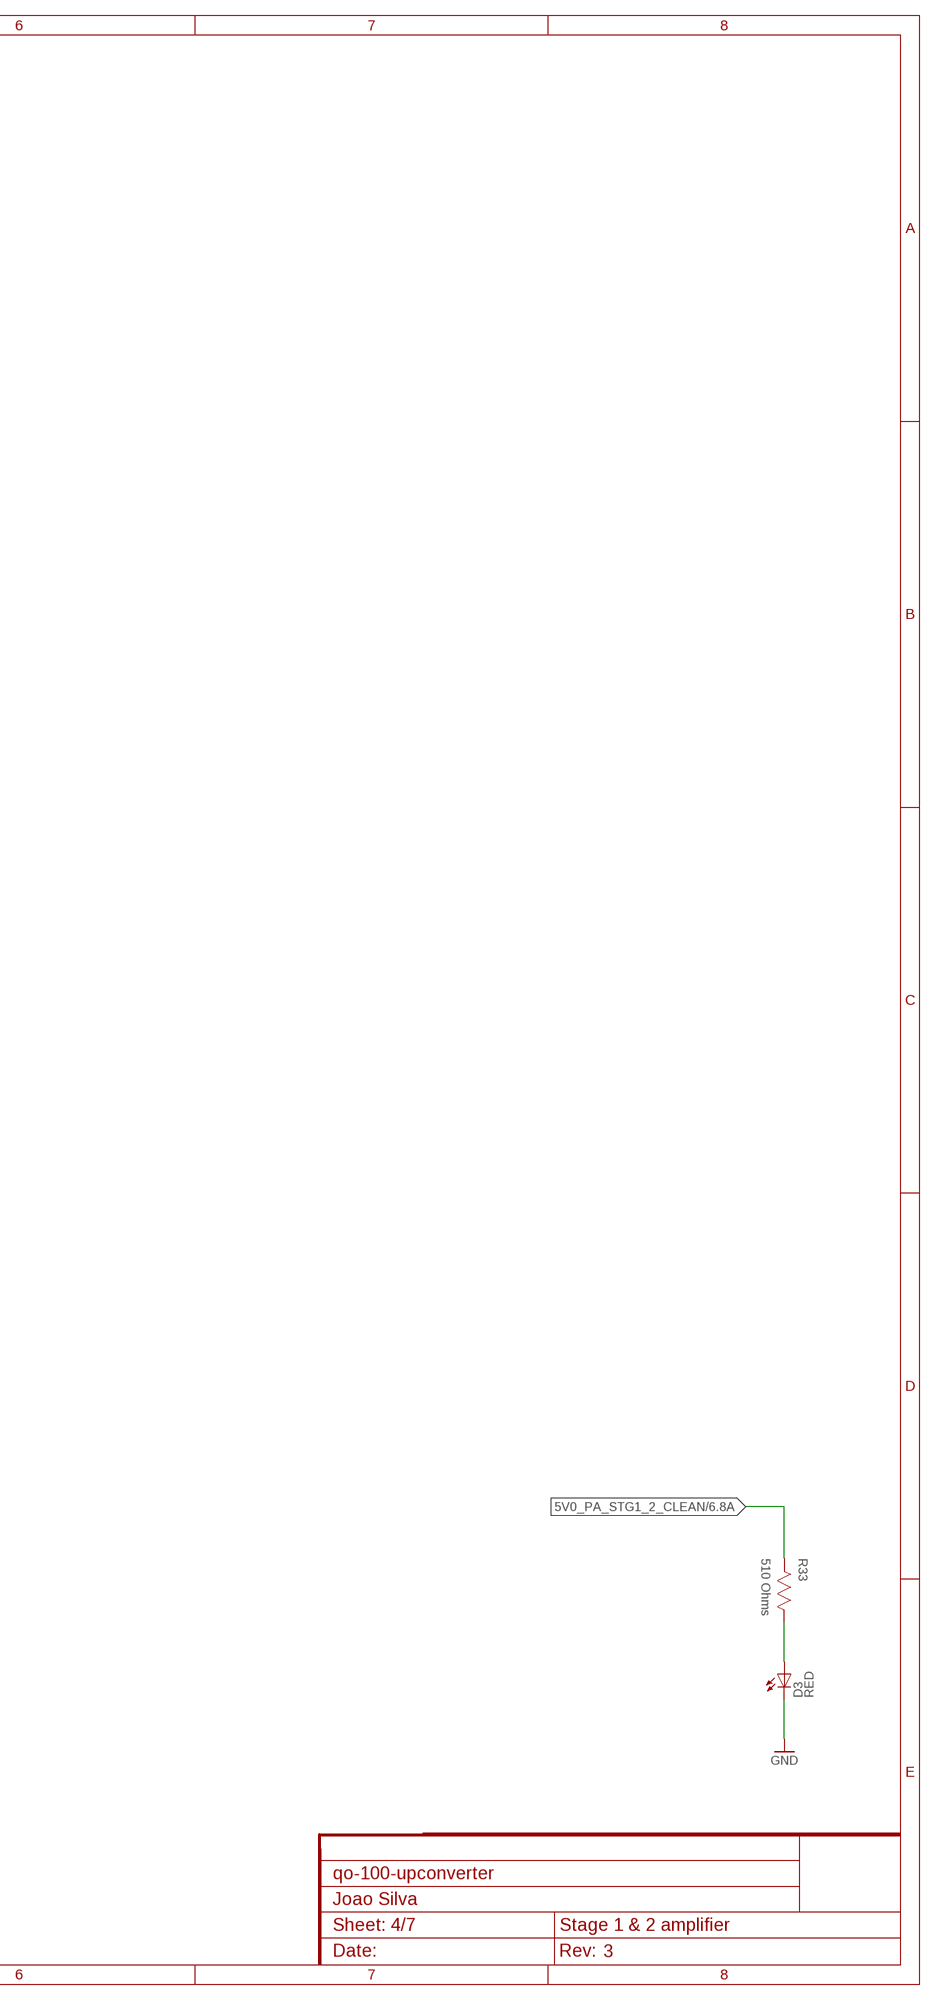
[diagram p7: schematic, sheet 4, part 2 of 2]

### Parts
C36  100uF  CAPACITOR-1206  [CAP1206]
C37  1uF  CAPACITOR-0603  [CAP0603]
C38  100nF  CAPACITOR-0603  [CAP0603]
C39  1uF  CAPACITOR-0603  [CAP0603]
C40  33pF  CAPACITOR-0603  [CAP0603]
C41  100nF  CAPACITOR-0603  [CAP0603]
C42  0.8pF  CAPACITOR-0603  [CAP0603]
C43  100nF  CAPACITOR-0603  [CAP0603]
C44  10pF  CAPACITOR-0603  [CAP0603]
C45  47pF  CAPACITOR-0603  [CAP0603]
C46  1uF  CAPACITOR-0603  [CAP0603]
C47  15pF  CAPACITOR-0603  [CAP0603]
C48  100nF  CAPACITOR-0603  [CAP0603]
C49  33pF  CAPACITOR-0603  [CAP0603]
C50  15pF  CAPACITOR-0603  [CAP0603]
C51  15pF  CAPACITOR-0603  [CAP0603]
C52  22pF  CAPACITOR-0603  [CAP0603]
C53  0.7pF  CAPACITOR-0603  [CAP0603]
D3  LED0603  [0603]
L15  1.5nH  INDUCTOR-0603  [IND0603]
L16  470nH  INDUCTOR-0603  [IND0603]
L17  2.2nH  INDUCTOR-0603  [IND0603]
R28  1K Ohms  RESISTOR-0603  [RES0603]
R29  0 Ohms  RESISTOR-0603  [RES0603]
R30  DNP  RESISTOR-0603  [RES0603]
R31  1.5K Ohms  RESISTOR-0603  [RES0603]
R32  0 Ohms  RESISTOR-0603  [RES0603]
R33  510 Ohms  RESISTOR-0603  [RES0603]
RFCON6  RFCON-U.FL  [U.FL]
U6  2450BP15E0100  [2450BP15E0100]
U7  F1958NBGK  [QFN24_2]
U8  ADL5601  [SOT89]
U9  F1490NLGA  [QFN16]

### Nets
3V3_RF_ATT_PDET_CLEAN: C41.1(C1) U7.2(VDD) U7.3(VMODE) ; also sheet 5,6
5V0_PA_STG1_2_CLEAN: C36.1(C1) C37.1(C1) C38.1(C1) C39.1(C1) C40.1(C1) C43.1(C1) C45.1(C1) C46.1(C1) C47.1(C1) C48.1(C1) C49.1(C1) L15.2 L16.2 L17.2 R28.2 R29.2 R31.2 R33.2 ; also sheet 6
GND: C36.2(C2) C37.2(C2) C38.2(C2) C39.2(C2) C40.2(C2) C41.2(C2) C42.2(C2) C43.2(C2) C45.2(C2) C46.2(C2) C47.2(C2) C48.2(C2) C49.2(C2) C53.2(C2) D3.C RFCON6.P$1(GND) RFCON6.P$2(GND) U6.1(GND) U6.3(GND) U7.1(D0) U7.4(GND) U7.6(GND) U7.7(GND) U7.8(GND) U7.9(GND) U7.10(GND) U7.11(GND) U7.12(GND) U7.13(GND) U7.15(GND) U7.19(D6) U7.20(D5) U7.21(D4) U7.22(D3) U7.23(D2) U7.24(D1) U7.25(GND) U8.2(GND) U8.4(GND) U9.1(GND) U9.3(GND) U9.5(GND) U9.6(GND) U9.7(GND) U9.8(GND) U9.9(GND) U9.12(GND) U9.17(GND) ; also sheet 1,2,3,5,6
N$4: R29.1 U9.15(GAIN_SEL)
N$12: L15.1 U9.4(VDD)
N$15: R28.1 U9.14(BIAS1)
N$16: R31.1 U9.13(BIAS2)
N$23: D3.A R33.1
N$30: C44.2(C2) U9.2(RFIN)
N$35: R30.2 RFCON6.P$3(SIGNAL)
RF_ATT1_LE: U7.16(LE) ; also sheet 1
RF_LOL_FLT_ACC: U8.1(RFIN) ; also sheet 3
RF_PRE1_ACC: C51.2(C2) U7.14(RF2)
RF_PRE1_ATT_ACC: R32.1 U6.4(RFIN)
RF_PRE1_ATT_ACC_PROBE: C50.2(C2) R30.1 R32.2
RF_PRE1_ATT_DCC: C50.1(C1) U7.5(RF1)
RF_PRE1_ATT_FLT_ACC: C42.1(C1) C44.1(C1) U6.2(RFOUT)
RF_PRE1_DCC: C51.1(C1) L16.1 U8.3(RFOUT)
RF_PRE2_ACC: C52.2(C2) C53.1(C1) ; also sheet 5
RF_PRE2_DCC: C52.1(C1) L17.1 U9.10(RFOUT) U9.11(RFOUT)
SPI_MOSI: U7.18(DATA) ; also sheet 1,2,3,5
SPI_SCK: U7.17(CLK) ; also sheet 1,2,3,5
Unconnected: U9.16(!STBY)

### Notes on the sheet
- +13.8 dB
- -1.2 dB to -32.5 dB
- +39.5 dB
- -2 dB to -4 dB

## Sheet 5 of 7: Final (stage 3) amplifier + Power Detector
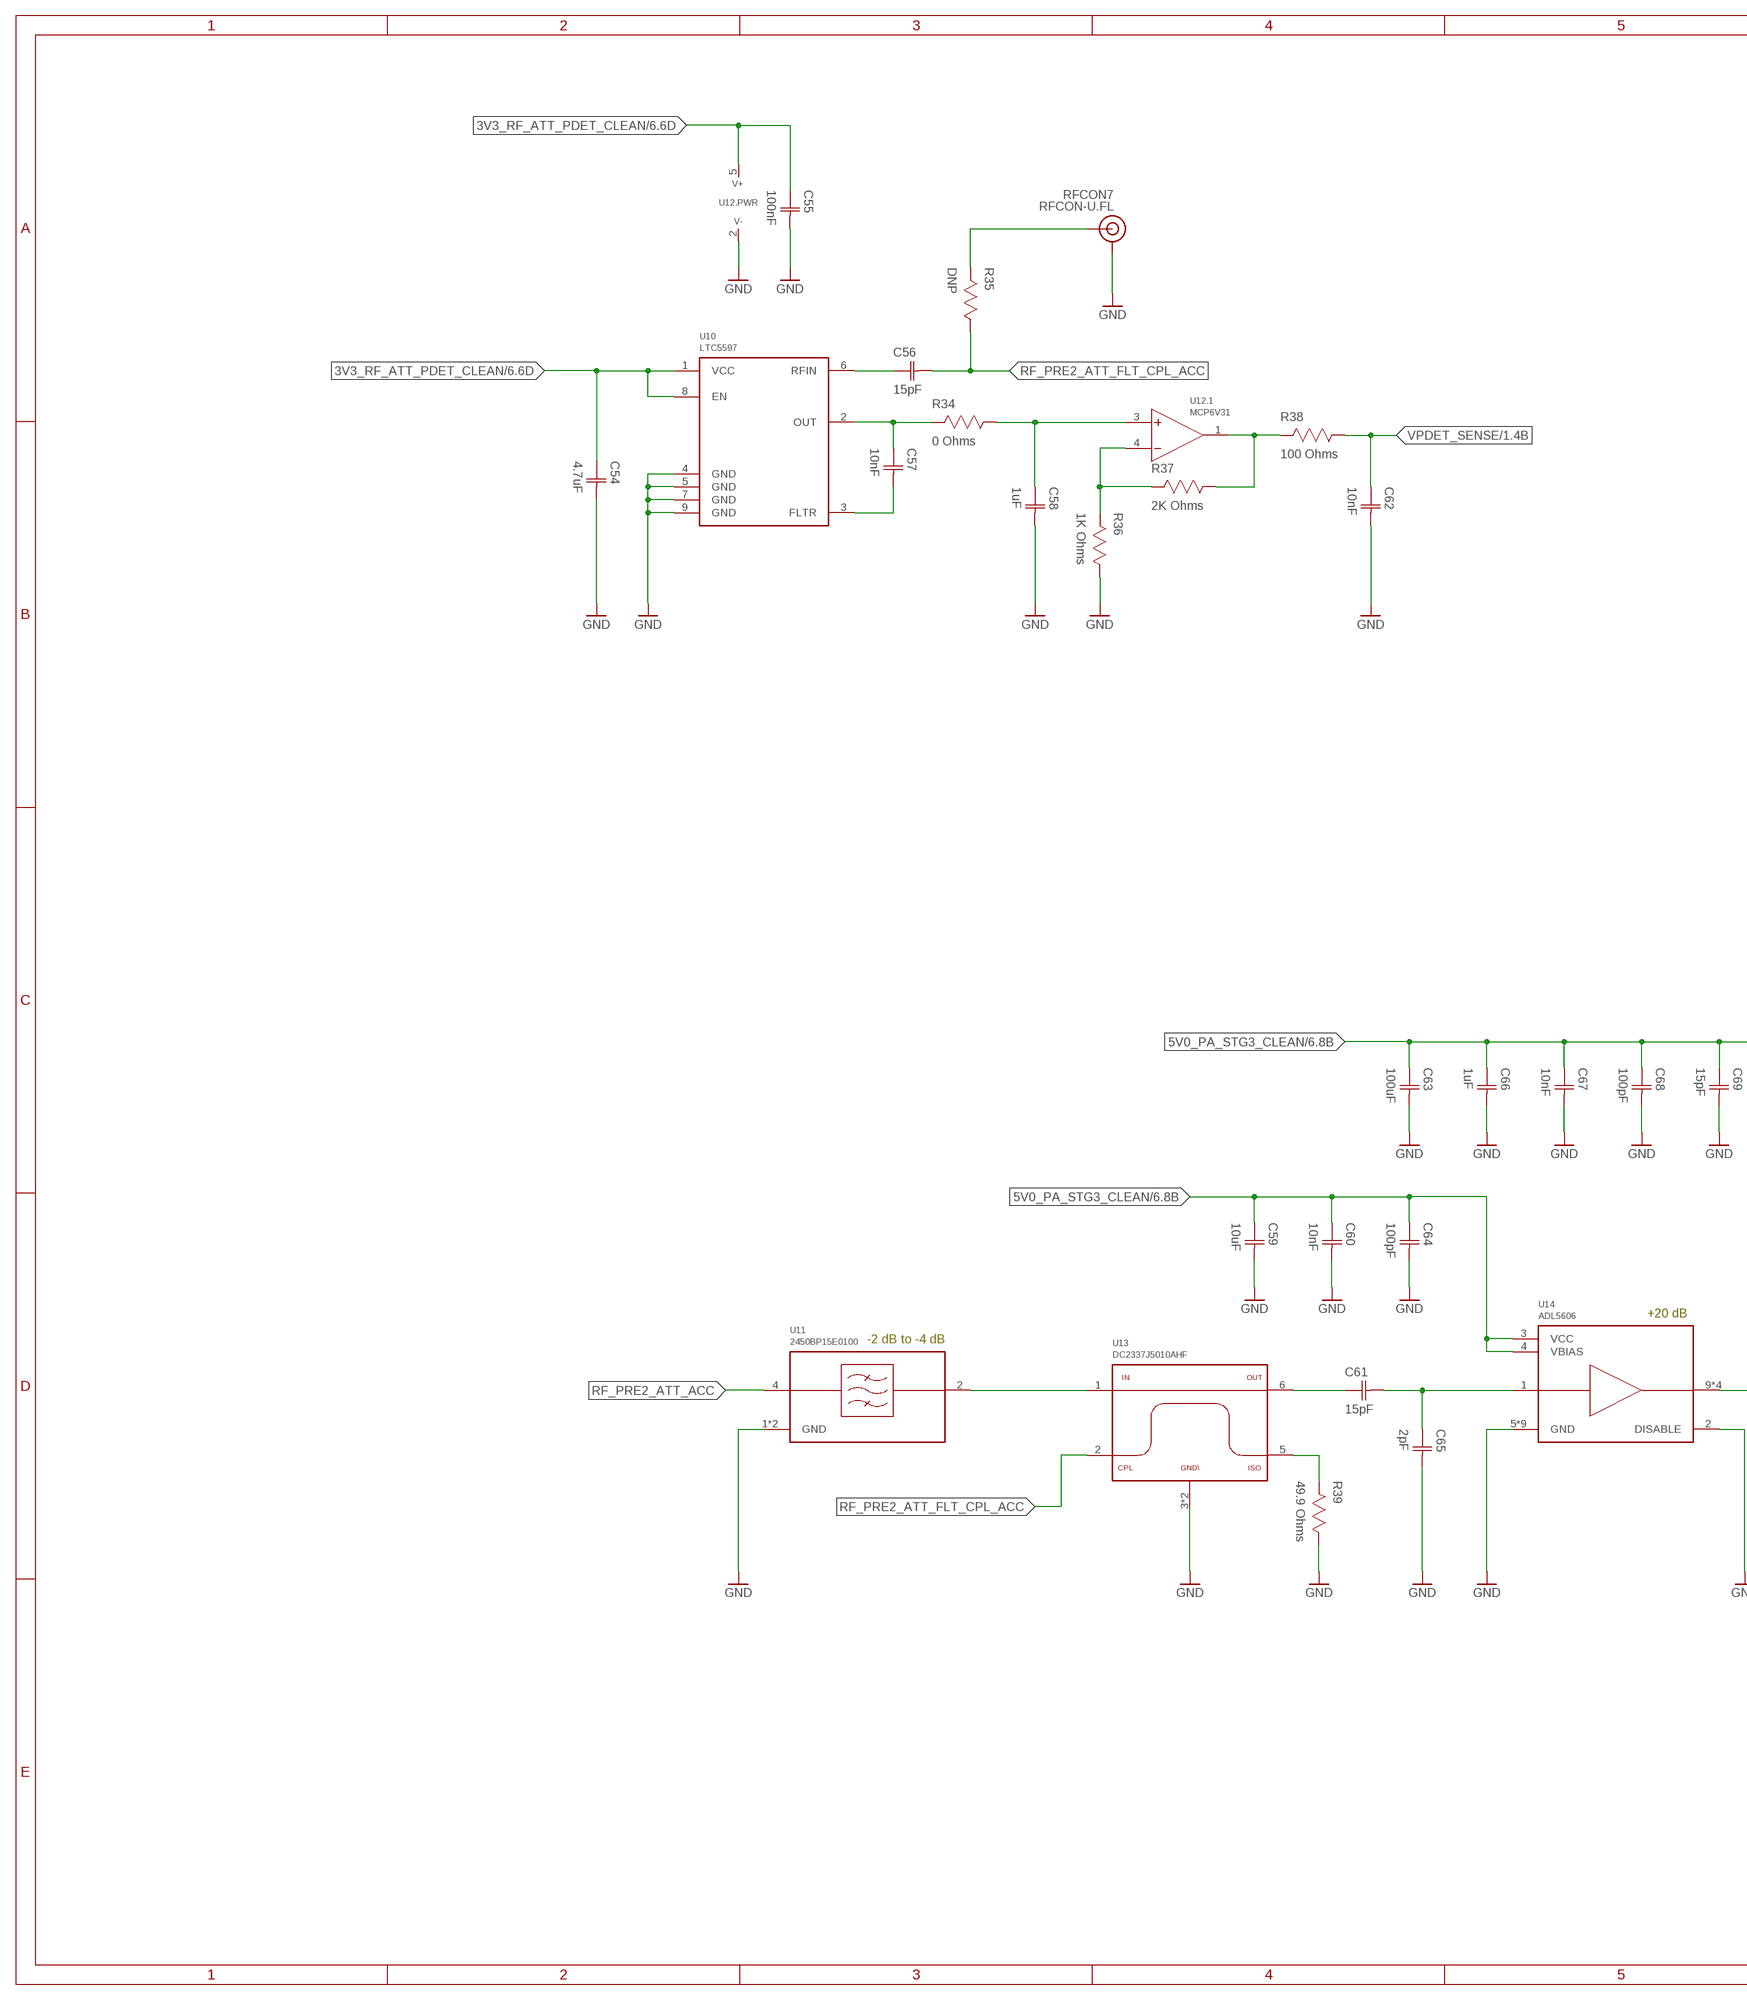
[diagram p8: schematic, sheet 5, part 1 of 2]
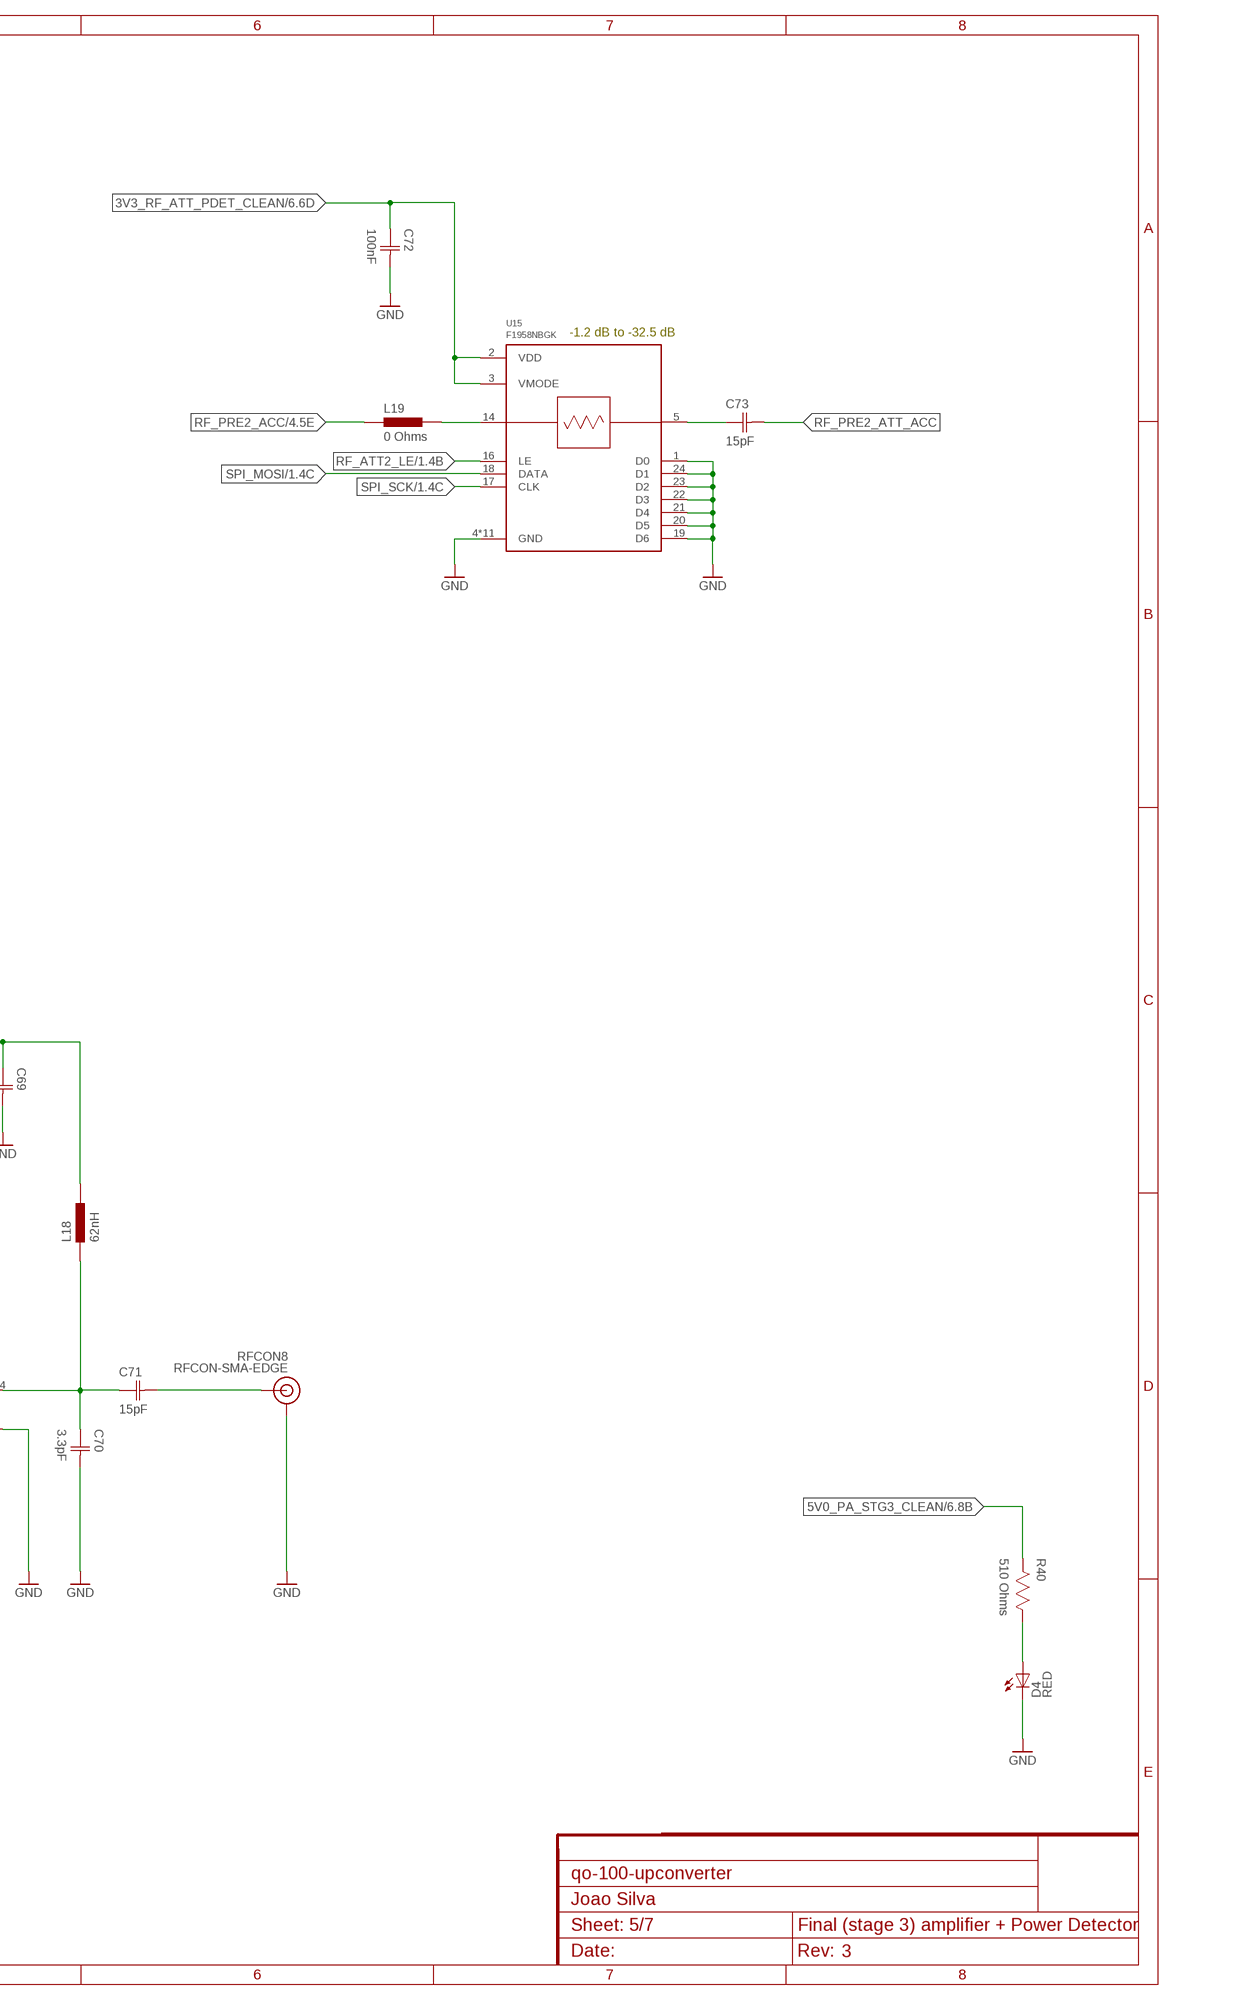
[diagram p9: schematic, sheet 5, part 2 of 2]

### Parts
C54  4.7uF  CAPACITOR-0603  [CAP0603]
C55  100nF  CAPACITOR-0603  [CAP0603]
C56  15pF  CAPACITOR-0603  [CAP0603]
C57  10nF  CAPACITOR-0603  [CAP0603]
C58  1uF  CAPACITOR-0603  [CAP0603]
C59  10uF  CAPACITOR-0603  [CAP0603]
C60  10nF  CAPACITOR-0603  [CAP0603]
C61  15pF  CAPACITOR-0603  [CAP0603]
C62  10nF  CAPACITOR-0603  [CAP0603]
C63  100uF  CAPACITOR-1206  [CAP1206]
C64  100pF  CAPACITOR-0603  [CAP0603]
C65  2pF  CAPACITOR-0603  [CAP0603]
C66  1uF  CAPACITOR-0603  [CAP0603]
C67  10nF  CAPACITOR-0603  [CAP0603]
C68  100pF  CAPACITOR-0603  [CAP0603]
C69  15pF  CAPACITOR-0603  [CAP0603]
C70  3.3pF  CAPACITOR-0603  [CAP0603]
C71  15pF  CAPACITOR-0603  [CAP0603]
C72  100nF  CAPACITOR-0603  [CAP0603]
C73  15pF  CAPACITOR-0603  [CAP0603]
D4  LED0603  [0603]
L18  62nH  INDUCTOR-0603  [IND0603]
L19  0 Ohms  INDUCTOR-0603  [IND0603]
R34  0 Ohms  RESISTOR-0603  [RES0603]
R35  DNP  RESISTOR-0603  [RES0603]
R36  1K Ohms  RESISTOR-0603  [RES0603]
R37  2K Ohms  RESISTOR-0603  [RES0603]
R38  100 Ohms  RESISTOR-0603  [RES0603]
R39  49.9 Ohms  RESISTOR-0603  [RES0603]
R40  510 Ohms  RESISTOR-0603  [RES0603]
RFCON7  RFCON-U.FL  [U.FL]
RFCON8  RFCON-SMA-EDGE  [SMA-EDGE]
U10  LTC5597  [DFN8_2X2]
U11  2450BP15E0100  [2450BP15E0100]
U12  MCP6V31  [SOT23-5]
U13  DC2337J5010AHF  [DC2337J5010AHF]
U14  ADL5606  [LFCSP16_4X4]
U15  F1958NBGK  [QFN24_2]

### Nets
3V3_RF_ATT_PDET_CLEAN: C54.1(C1) C55.1(C1) C72.1(C1) U10.1(VCC) U10.8(EN) U12.5(.PWR:V+) U15.2(VDD) U15.3(VMODE) ; also sheet 4,6
5V0_PA_STG3_CLEAN: C59.1(C1) C60.1(C1) C63.1(C1) C64.1(C1) C66.1(C1) C67.1(C1) C68.1(C1) C69.1(C1) L18.2 R40.2 U14.3(VCC) U14.4(VBIAS) ; also sheet 6
GND: C54.2(C2) C55.2(C2) C58.2(C2) C59.2(C2) C60.2(C2) C62.2(C2) C63.2(C2) C64.2(C2) C65.2(C2) C66.2(C2) C67.2(C2) C68.2(C2) C69.2(C2) C70.2(C2) C72.2(C2) D4.C R36.1 R39.1 RFCON7.P$1(GND) RFCON7.P$2(GND) RFCON8.GND@0(GND) RFCON8.GND@1(GND) RFCON8.GND@2(GND) RFCON8.GND@3(GND) U10.4(GND) U10.5(GND) U10.7(GND) U10.9(GND) U11.1(GND) U11.3(GND) U12.2(.PWR:V-) U13.3(GND) U13.4(GND) U14.2(DISABLE) U14.5(GND) U14.6(GND) U14.7(GND) U14.8(GND) U14.13(GND) U14.14(GND) U14.15(GND) U14.16(GND) U14.17(GND) U15.1(D0) U15.4(GND) U15.6(GND) U15.7(GND) U15.8(GND) U15.9(GND) U15.10(GND) U15.11(GND) U15.12(GND) U15.13(GND) U15.15(GND) U15.19(D6) U15.20(D5) U15.21(D4) U15.22(D3) U15.23(D2) U15.24(D1) U15.25(GND) ; also sheet 1,2,3,4,6
N$3: D4.A R40.1
N$5: C61.2(C2) C65.1(C1) U14.1(RFIN)
N$7: R36.2 R37.2 U12.4(.1:-IN)
N$39: L19.2 U15.14(RF2)
N$42: R39.2 U13.5(ISOLATED)
N$43: C56.1(C1) U10.6(RFIN)
N$44: C57.2(C2) U10.3(FLTR)
N$48: R35.2 RFCON7.P$3(SIGNAL)
RF_ATT2_LE: U15.16(LE) ; also sheet 1
RF_FINAL_ACC: C71.2(C2) RFCON8.SIG(SIGNAL)
RF_FINAL_DCC: C70.1(C1) C71.1(C1) L18.1 U14.9(RFOUT) U14.10(RFOUT) U14.11(RFOUT) U14.12(RFOUT)
RF_PRE2_ACC: L19.1 ; also sheet 4
RF_PRE2_ATT_ACC: C73.2(C2) U11.4(RFIN)
RF_PRE2_ATT_DCC: C73.1(C1) U15.5(RF1)
RF_PRE2_ATT_FLT_ACC: U11.2(RFOUT) U13.1(IN)
RF_PRE2_ATT_FLT_CPL_ACC: C56.2(C2) R35.1 U13.2(COUPLED)
RF_PRE2_ATT_FLT_THRU_ACC: C61.1(C1) U13.6(OUT)
SPI_MOSI: U15.18(DATA) ; also sheet 1,2,3,4
SPI_SCK: U15.17(CLK) ; also sheet 1,2,3,4
VPDET_AMP: R37.1 R38.2 U12.1(.1:OUT)
VPDET_FLT: C58.1(C1) R34.1 U12.3(.1:+IN)
VPDET_RAW: C57.1(C1) R34.2 U10.2(OUT)
VPDET_SENSE: C62.1(C1) R38.1 ; also sheet 1

### Notes on the sheet
- -1.2 dB to -32.5 dB
- +20 dB
- -2 dB to -4 dB

## Sheet 6 of 7: Power
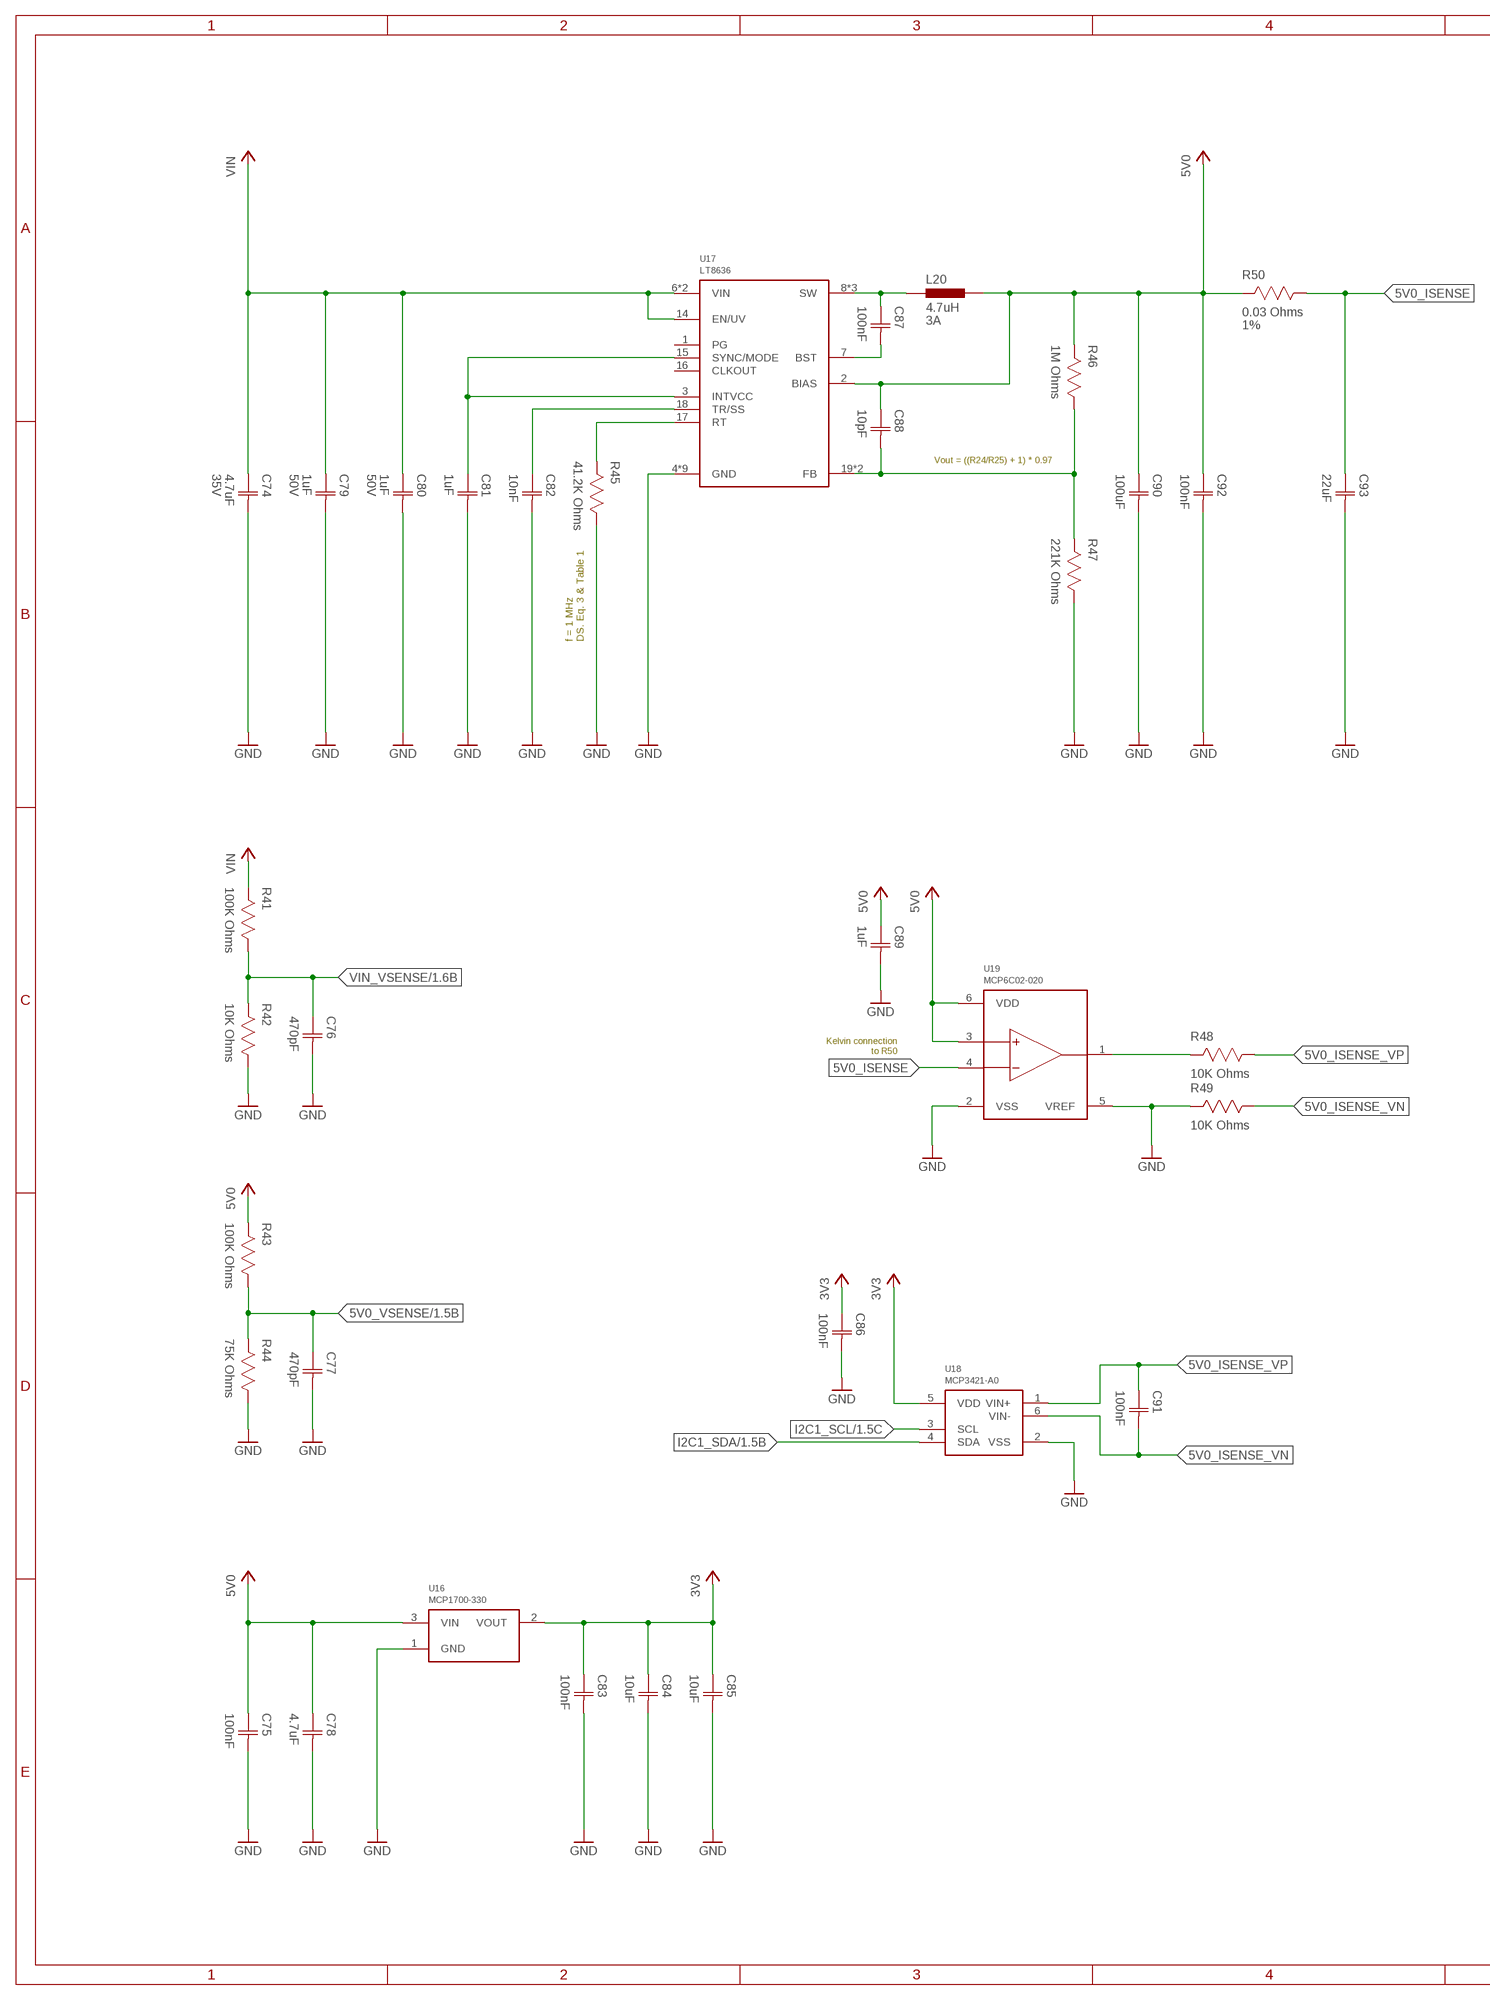
[diagram p10: schematic, sheet 6, part 1 of 2]
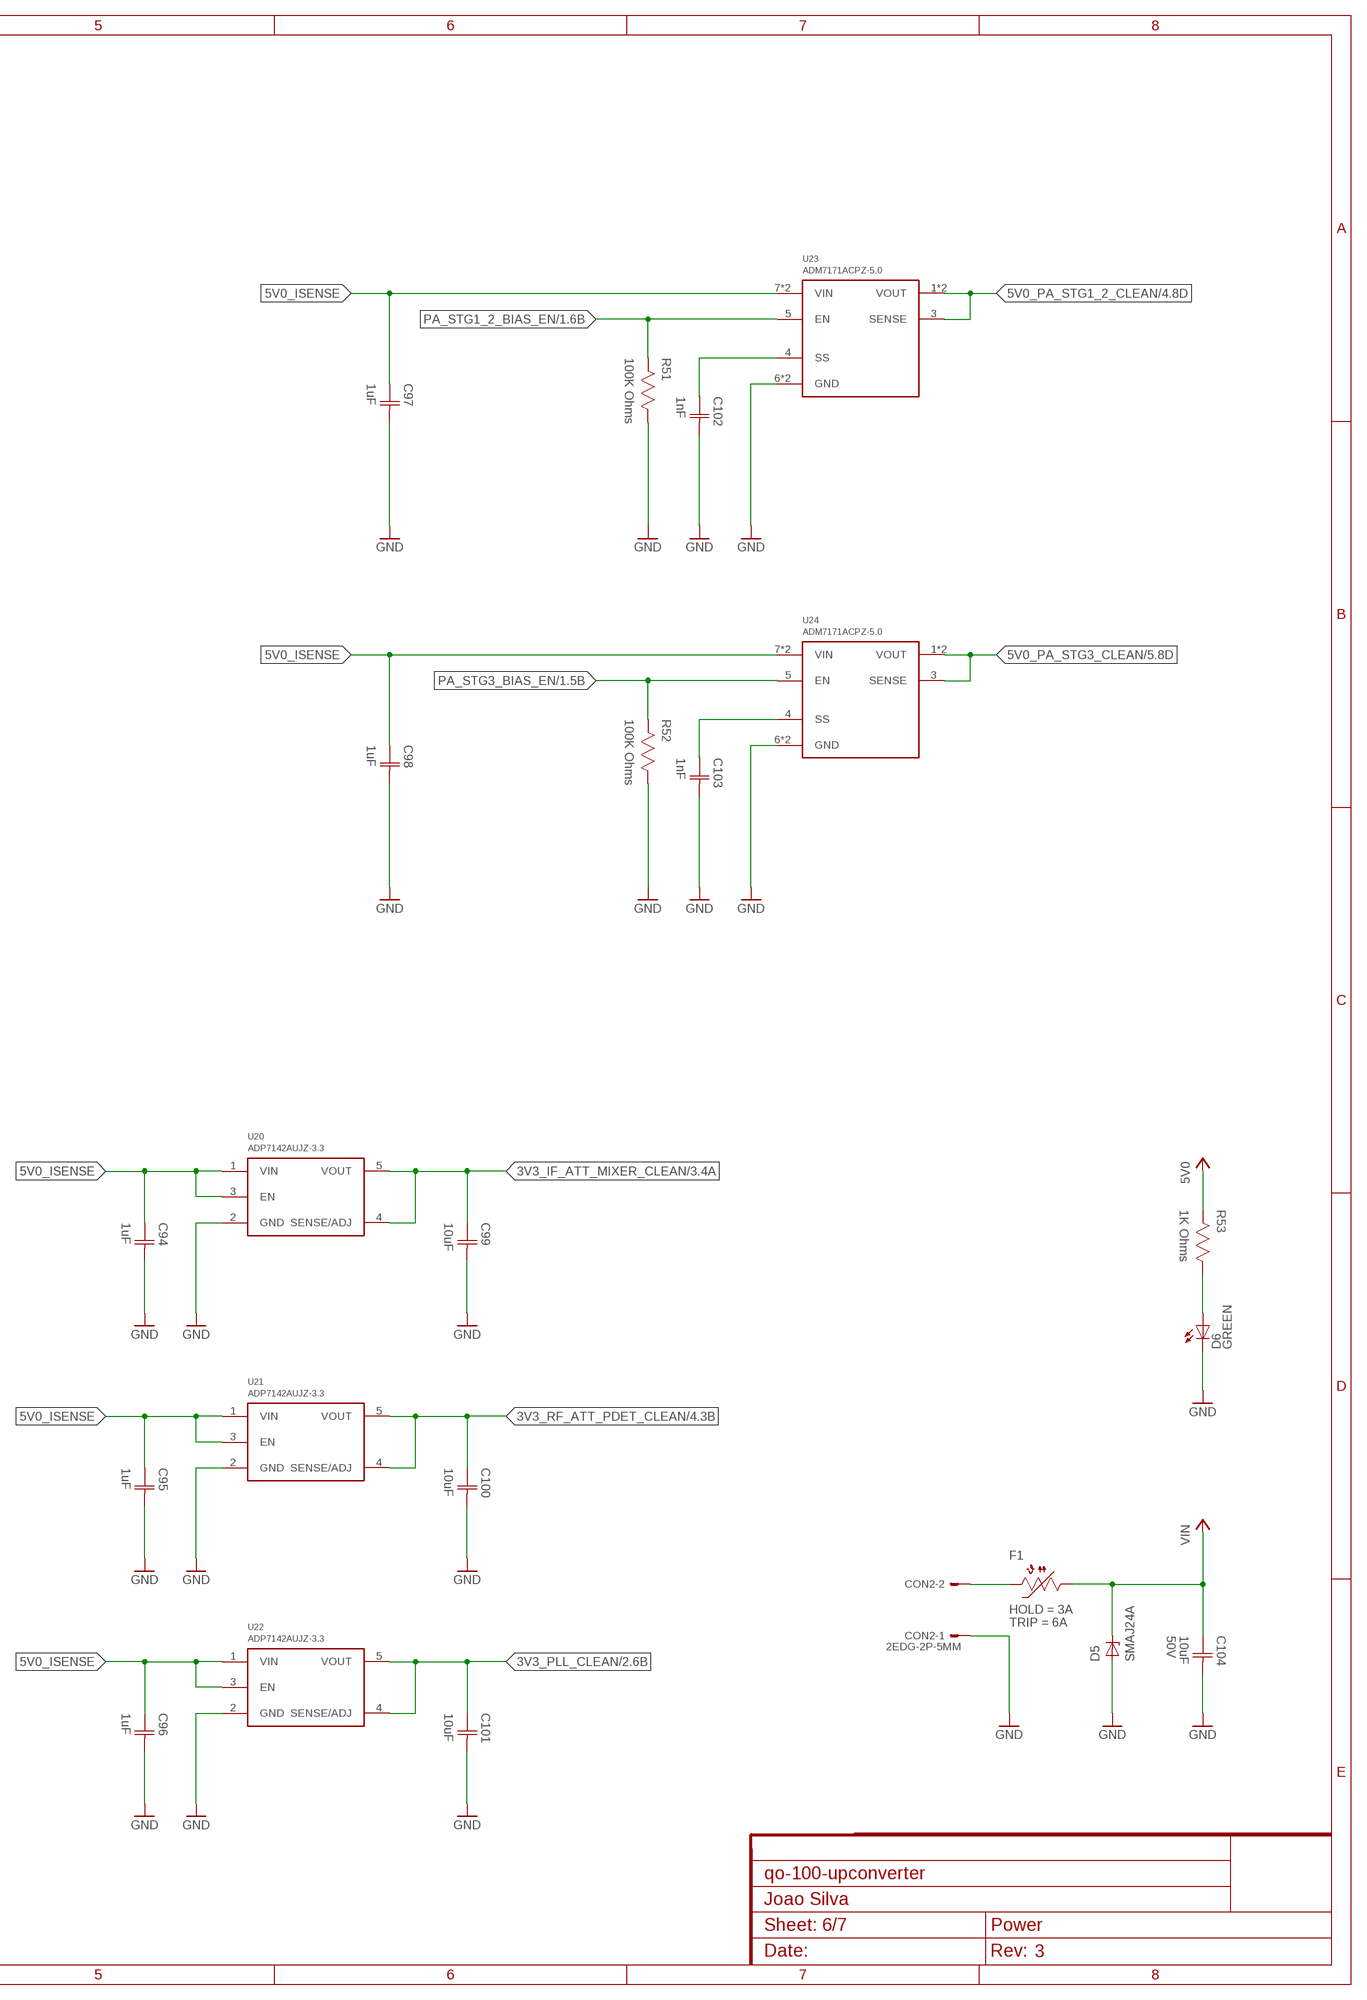
[diagram p11: schematic, sheet 6, part 2 of 2]

### Parts
C74  4.7uF  CAPACITOR-0603  [CAP0603]
C75  100nF  CAPACITOR-0603  [CAP0603]
C76  470pF  CAPACITOR-0603  [CAP0603]
C77  470pF  CAPACITOR-0603  [CAP0603]
C78  4.7uF  CAPACITOR-0603  [CAP0603]
C79  1uF  CAPACITOR-0603  [CAP0603]
C80  1uF  CAPACITOR-0603  [CAP0603]
C81  1uF  CAPACITOR-0603  [CAP0603]
C82  10nF  CAPACITOR-0603  [CAP0603]
C83  100nF  CAPACITOR-0603  [CAP0603]
C84  10uF  CAPACITOR-0603  [CAP0603]
C85  10uF  CAPACITOR-0603  [CAP0603]
C86  100nF  CAPACITOR-0603  [CAP0603]
C87  100nF  CAPACITOR-0603  [CAP0603]
C88  10pF  CAPACITOR-0603  [CAP0603]
C89  1uF  CAPACITOR-0603  [CAP0603]
C90  100uF  CAPACITOR-1206  [CAP1206]
C91  100nF  CAPACITOR-0603  [CAP0603]
C92  100nF  CAPACITOR-0603  [CAP0603]
C93  22uF  CAPACITOR-1206  [CAP1206]
C94  1uF  CAPACITOR-0603  [CAP0603]
C95  1uF  CAPACITOR-0603  [CAP0603]
C96  1uF  CAPACITOR-0603  [CAP0603]
C97  1uF  CAPACITOR-0603  [CAP0603]
C98  1uF  CAPACITOR-0603  [CAP0603]
C99  10uF  CAPACITOR-0603  [CAP0603]
C100  10uF  CAPACITOR-0603  [CAP0603]
C101  10uF  CAPACITOR-0603  [CAP0603]
C102  1nF  CAPACITOR-0603  [CAP0603]
C103  1nF  CAPACITOR-0603  [CAP0603]
C104  10uF  CAPACITOR-1206  [CAP1206]
CON2  2EDG-2P-5MM  [2EDG-2P-5MM]
D5  SMAJ24A  [DO214AC]
D6  LED0603  [0603]
F1  2.6A Hold  PTC1206  [1206]
L20  4.7uH  INDUCTOR-6X6MM  [IND0606]
R41  100K Ohms  RESISTOR-0603  [RES0603]
R42  10K Ohms  RESISTOR-0603  [RES0603]
R43  100K Ohms  RESISTOR-0603  [RES0603]
R44  75K Ohms  RESISTOR-0603  [RES0603]
R45  41.2K Ohms  RESISTOR-0603  [RES0603]
R46  1M Ohms  RESISTOR-0603  [RES0603]
R47  221K Ohms  RESISTOR-0603  [RES0603]
R48  10K Ohms  RESISTOR-0603  [RES0603]
R49  10K Ohms  RESISTOR-0603  [RES0603]
R50  0.03 Ohms  RESISTOR-1206  [RES1206]
R51  100K Ohms  RESISTOR-0603  [RES0603]
R52  100K Ohms  RESISTOR-0603  [RES0603]
R53  1K Ohms  RESISTOR-0603  [RES0603]
U16  MCP1700-330  [SOT23]
U17  LT8636  [QFN20_ASYM_CORNER]
U18  MCP3421-A0  [SOT23-6]
U19  MCP6C02-020  [SOT23-6]
U20  ADP7142AUJZ-3.3  [SOT23-5]
U21  ADP7142AUJZ-3.3  [SOT23-5]
U22  ADP7142AUJZ-3.3  [SOT23-5]
U23  ADM7171ACPZ-5.0  [LFCSP8_3X3]
U24  ADM7171ACPZ-5.0  [LFCSP8_3X3]

### Nets
3V3: C83.1(C1) C84.1(C1) C85.1(C1) C86.1(C1) U16.2(VOUT) U18.5(VDD) ; also sheet 1
3V3_IF_ATT_MIXER_CLEAN: C99.1(C1) U20.4(SENSE/ADJ) U20.5(VOUT) ; also sheet 3
3V3_PLL_CLEAN: C101.1(C1) U22.4(SENSE/ADJ) U22.5(VOUT) ; also sheet 2
3V3_RF_ATT_PDET_CLEAN: C100.1(C1) U21.4(SENSE/ADJ) U21.5(VOUT) ; also sheet 4,5
5V0: C75.1(C1) C78.1(C1) C88.1(C1) C89.1(C1) C90.1(C1) C92.1(C1) L20.2 R43.2 R46.2 R50.2 R53.2 U16.3(VIN) U17.2(BIAS) U19.3(VIP) U19.6(VDD)
5V0_BST: C87.2(C2) U17.7(BST)
5V0_FB: C88.2(C2) R46.1 R47.2 U17.19(FB) U17.20(FB)
5V0_INTVCC: C81.1(C1) U17.3(INTVCC) U17.15(SYNC/MODE)
5V0_ISENSE: C93.1(C1) C94.1(C1) C95.1(C1) C96.1(C1) C97.1(C1) C98.1(C1) R50.1 U19.4(VIM) U20.1(VIN) U20.3(EN) U21.1(VIN) U21.3(EN) U22.1(VIN) U22.3(EN) U23.7(VIN) U23.8(VIN) U24.7(VIN) U24.8(VIN)
5V0_ISENSE_VN: C91.2(C2) R49.1 U18.6(VIN-)
5V0_ISENSE_VP: C91.1(C1) R48.1 U18.1(VIN+)
5V0_PA_STG1_2_CLEAN: U23.1(VOUT) U23.2(VOUT) U23.3(SENSE) ; also sheet 4
5V0_PA_STG3_CLEAN: U24.1(VOUT) U24.2(VOUT) U24.3(SENSE) ; also sheet 5
5V0_RT: R45.2 U17.17(RT)
5V0_SS: C82.1(C1) U17.18(TR/SS)
5V0_SW: C87.1(C1) L20.1 U17.8(SW) U17.9(SW) U17.10(SW)
5V0_VSENSE: C77.1(C1) R43.1 R44.2 ; also sheet 1
GND: C74.2(C2) C75.2(C2) C76.2(C2) C77.2(C2) C78.2(C2) C79.2(C2) C80.2(C2) C81.2(C2) C82.2(C2) C83.2(C2) C84.2(C2) C85.2(C2) C86.2(C2) C89.2(C2) C90.2(C2) C92.2(C2) C93.2(C2) C94.2(C2) C95.2(C2) C96.2(C2) C97.2(C2) C98.2(C2) C99.2(C2) C100.2(C2) C101.2(C2) C102.2(C2) C103.2(C2) C104.2(C2) CON2.P$1 D5.A D6.C R42.1 R44.1 R45.1 R47.1 R49.2 R51.1 R52.1 U16.1(GND) U17.4(GND) U17.5(GND) U17.12(GND) U17.13(GND) U17.21(GND) U17.M1(GND) U17.M2(GND) U17.M3(GND) U17.M4(GND) U18.2(VSS) U19.2(VSS) U19.5(VREF) U20.2(GND) U21.2(GND) U22.2(GND) U23.6(GND) U23.9(GND) U24.6(GND) U24.9(GND) ; also sheet 1,2,3,4,5
I2C1_SCL: U18.3(SCL) ; also sheet 1
I2C1_SDA: U18.4(SDA) ; also sheet 1
N$2: C103.1(C1) U24.4(SS)
N$10: R48.2 U19.1(VOUT)
N$19: CON2.P$2 F1.2
N$20: C102.1(C1) U23.4(SS)
N$149: D6.A R53.1
PA_STG1_2_BIAS_EN: R51.2 U23.5(EN) ; also sheet 1
PA_STG3_BIAS_EN: R52.2 U24.5(EN) ; also sheet 1
VIN: C74.1(C1) C79.1(C1) C80.1(C1) C104.1(C1) D5.C F1.1 R41.2 U17.6(VIN) U17.11(VIN) U17.14(EN/UV)
VIN_VSENSE: C76.1(C1) R41.1 R42.2 ; also sheet 1
Unconnected: U17.1(PG) U17.16(CLKOUT)

### Notes on the sheet
- Vout = ((R24/R25) + 1) * 0.97
- f = 1 MHz
  DS. Eq. 3 & Table 1
- Kelvin connection
  to R50

## Sheet 7 of 7: Power tree
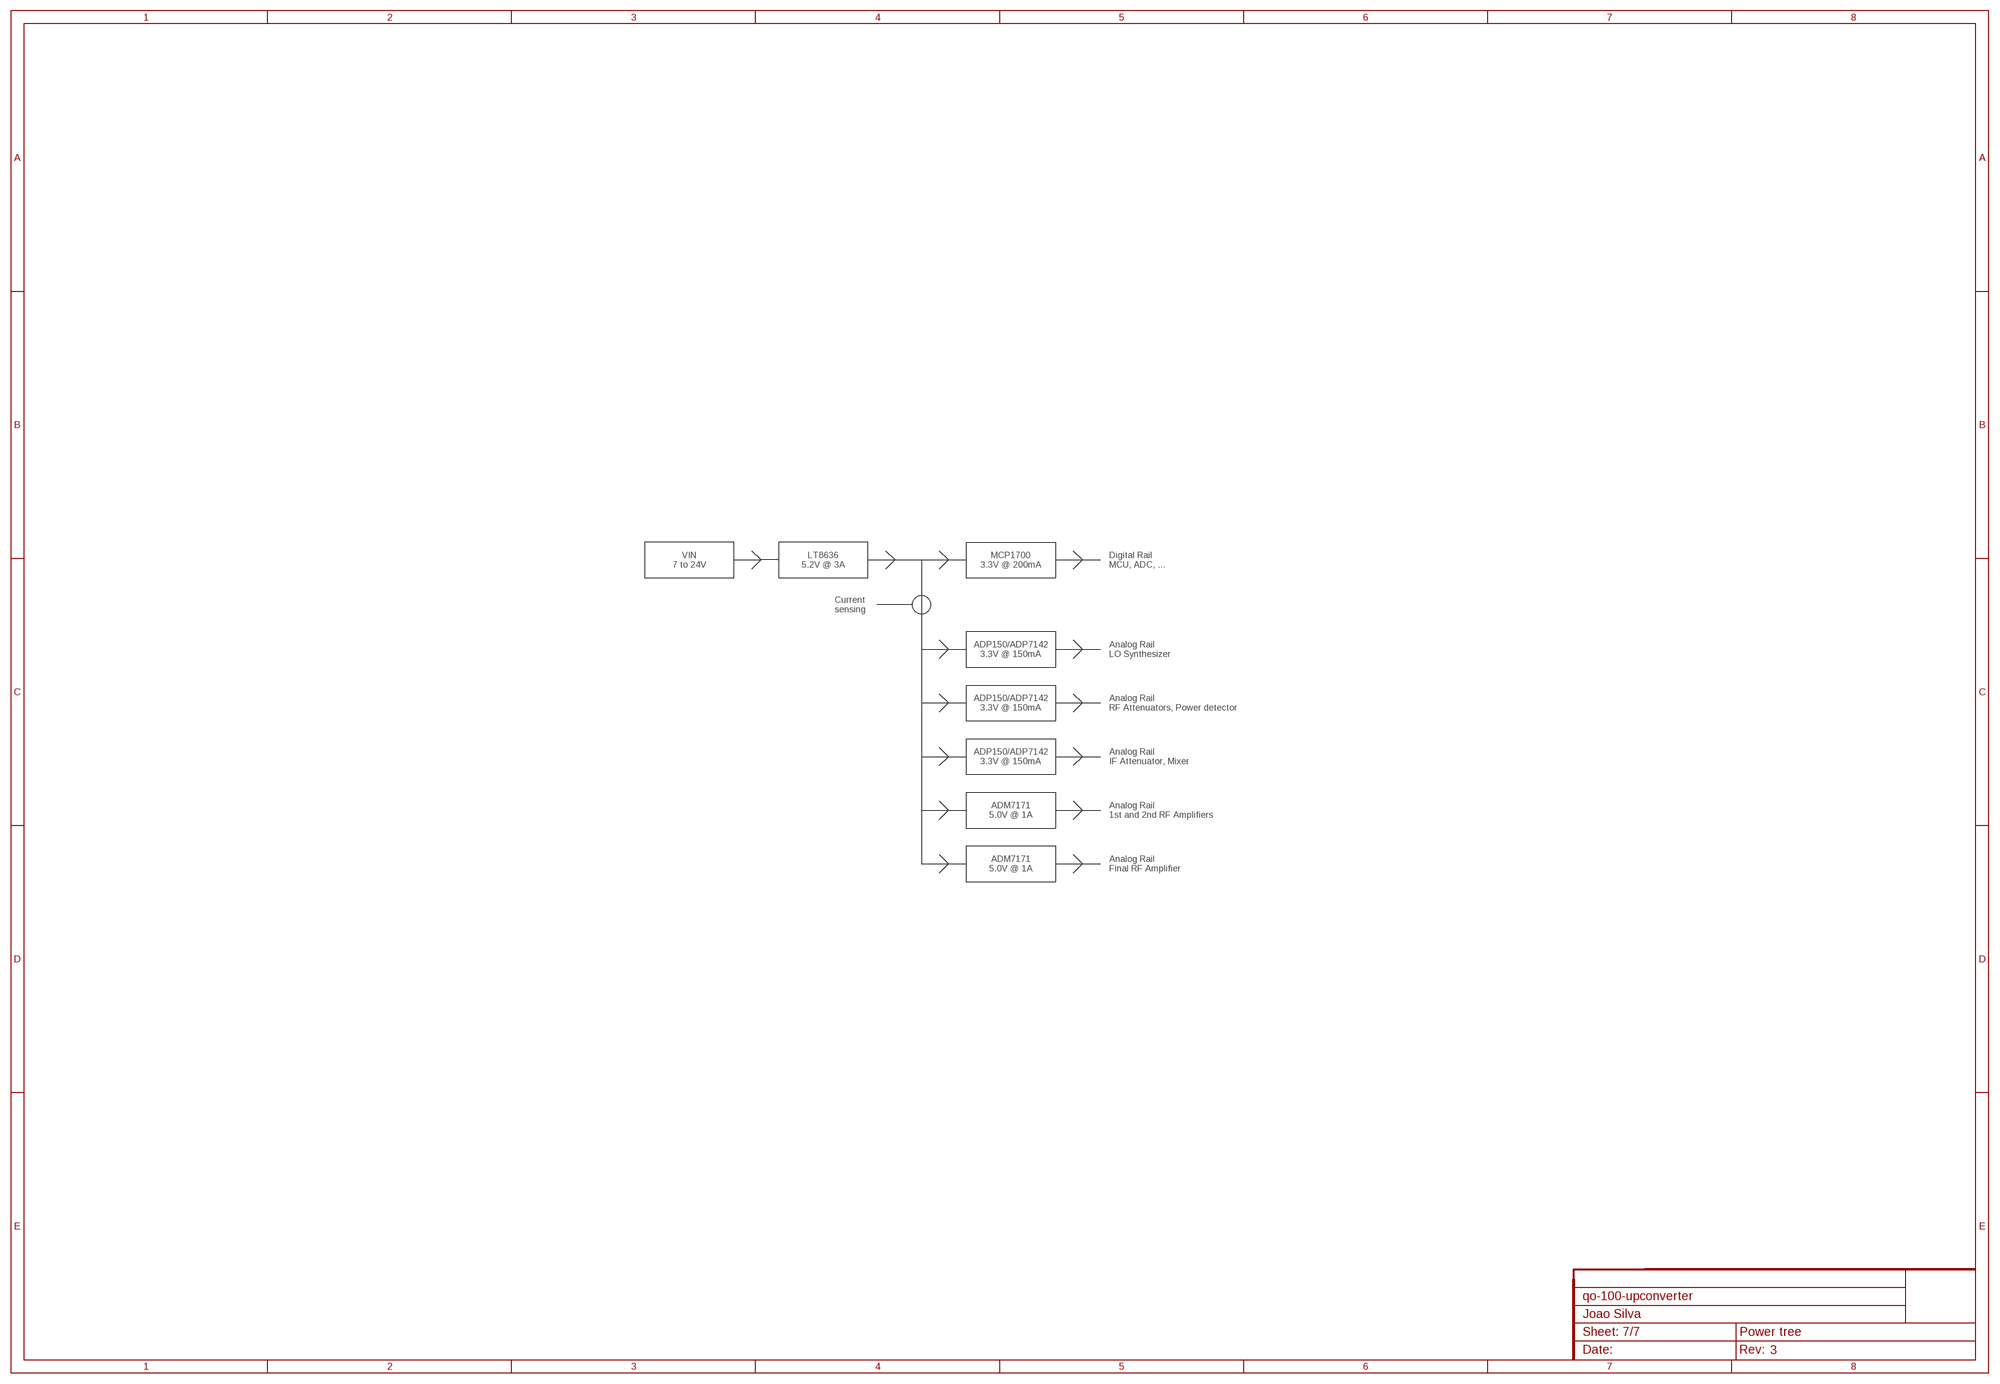
[diagram p12: schematic, sheet 7]

### Notes on the sheet
- VIN
  7 to 24V
- LT8636
  5.2V @ 3A
- MCP1700
  3.3V @ 200mA
- Digital Rail
  MCU, ADC, ...
- Current
  sensing
- ADP150/ADP7142
  3.3V @ 150mA
- Analog Rail
  LO Synthesizer
- ADP150/ADP7142
  3.3V @ 150mA
- Analog Rail
  RF Attenuators, Power detector
- ADP150/ADP7142
  3.3V @ 150mA
- Analog Rail
  IF Attenuator, Mixer
- ADM7171
  5.0V @ 1A
- Analog Rail
  1st and 2nd RF Amplifiers
- ADM7171
  5.0V @ 1A
- Analog Rail
  Final RF Amplifier

## Library data of the parts
C1-C73 C75-C78 C81-C103 = Capacitor:CAPACITOR
C74 = Capacitor:CAPACITOR; VOLTAGE: 35V
C79 C80 C104 = Capacitor:CAPACITOR; VOLTAGE: 50V
CON1 = JST:3P: Disconnectable Crimp style connector, 1.0mm pitch 3 contacts
CON2 = Generic Connector:2EDG-2P
D1 D2 = LED:LED; COLOR: BLUE
D3 D4 = LED:LED; COLOR: RED
D5 = TVS:SMAJ*A: SMAJ Series TVS Diodes Source: http://www.littelfuse.com/~/media/electronics/datasheets/tvs_diodes/littelfuse_tvs_diode_smaj_datasheet.pdf.pdf; MF: Littelfuse; MPN: SMAJ24A; OC_FARNELL: 1886345; OC_NEWARK: 06R1865
D6 = LED:LED; COLOR: GREEN
F1 = PTC Fuses:PTC; HOLD: 3A; OCLCSC: C207041; TRIP: 6A
L1-L19 = Inductor:INDUCTOR
L20 = Inductor:INDUCTOR; CURRENT: 3A; OCLCSC: C326336
LOGO1 = Silkscreen:JS
R1-R49 R51-R53 = Resistor:RESISTOR
R50 = Resistor:RESISTOR; TOLERANCE: 1%
RFCON1-RFCON8 = RF Connector:RFCON
SHIELD1 = Shield:SHIELD
TC1 = TagConnect:TC2050-IDC
TP1-TP6 = PADs:TESTPOINT
U1 = EFM32:EFM32TG11B1*M32
U2 = Crystal:DSB321SDA
U3 = Analog Devices:ADF4351
U4 U7 U15 = Renesas:F1958*
U5 = Maxim Integrated:MAX2671
U6 U11 = Generic Filter:2450BP15E0100
U8 = Analog Devices:ADL5?
U9 = Renesas:F1490*
U10 = Analog Devices:LTC5597
U12 = Microchip:MCP6V31
U13 = Anaren:DC2337J5010AHF; OCLCSC: C509396
U14 = Analog Devices:ADL5606
U16 = Microchip:MCP1700-*
U17 = Analog Devices:LT8636
U18 = Microchip:MCP3421-A*
U19 = Microchip:MCP6C02
U20-U22 = Analog Devices:ADP7142AUJZ*
U23 U24 = Analog Devices:ADM7171ACPZ